# Altium project Discharge.PrjPcb
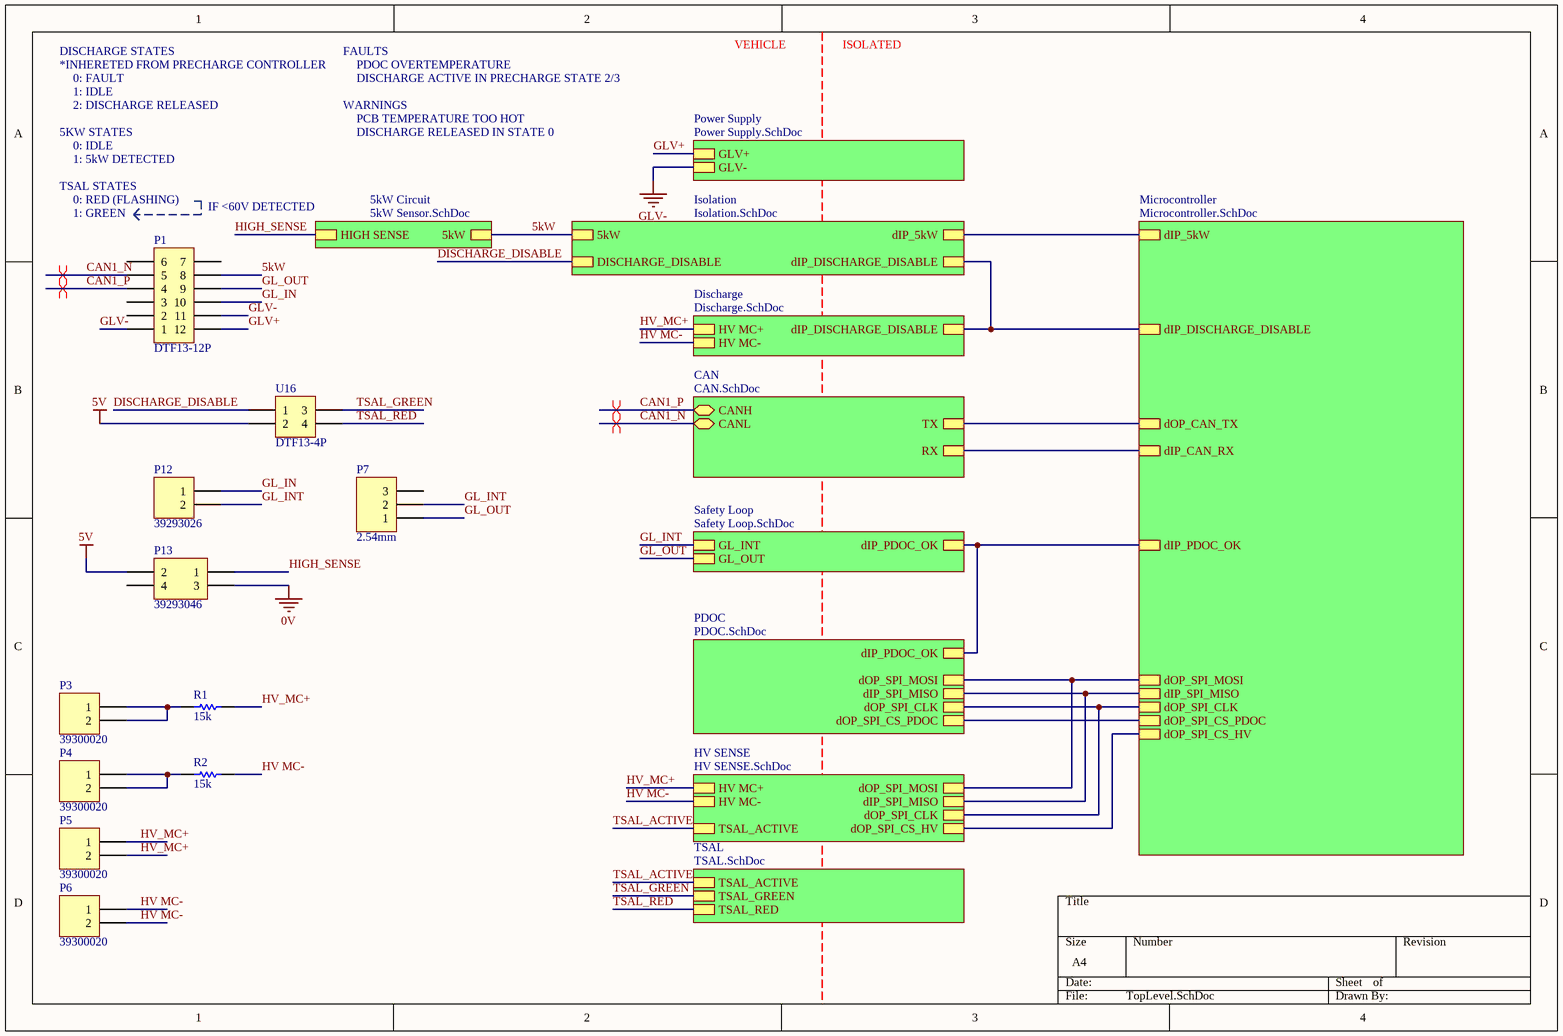
[diagram p0: TopLevel.SchDoc]
11 sheets, 172 parts. Net scope: hierarchical (ports join the sheet entries above them; power ports are global).
Board files: Discharge_B2.PcbDoc, Discharge_B3.PcbDoc, Discharge_B4.PcbDoc, Discharge_B5.PcbDoc
Sheets:
  TopLevel.SchDoc
    Power Supply = Power Supply.SchDoc
    Isolation = Isolation.SchDoc
    Safety Loop = Safety Loop.SchDoc
    Discharge = Discharge.SchDoc
    PDOC = PDOC.SchDoc
    HV SENSE = HV Sense.SchDoc
    Microcontroller = Microcontroller.SchDoc
    CAN = CAN.SchDoc
    5kW Circuit = 5kW Sensor.SchDoc
    TSAL = TSAL.SchDoc

## Sheet TopLevel.SchDoc
size A4; SheetNumber: 1; SheetTotal: 11

### Parts
P1  DTF13-12P  [DTF13-12P]
P3  39300020  [39300020]
P4  39300020  [39300020]
P5  39300020  [39300020]
P6  39300020  [39300020]
P7  2.54mm  [TH 2.54mm Header 1x3]
P12  39293026  [39293026]
P13  39293046  [39293046]
R1  15k  [TE_SMF7]
R2  15k  [TE_SMF7]
U16  DTF13-4P  [DTF13-4P]

### Sub-sheets
5kW Circuit = 5kW Sensor.SchDoc: 5kW, HIGH SENSE
CAN = CAN.SchDoc: CANH (bidir), CANL (bidir), TX, RX
Discharge = Discharge.SchDoc: dIP_DISCHARGE_DISABLE, HV MC+, HV MC-
HV SENSE = HV SENSE.SchDoc: HV MC+, HV MC-, dOP_SPI_MOSI, dIP_SPI_MISO, dOP_SPI_CLK, dOP_SPI_CS_HV, TSAL_ACTIVE
Isolation = Isolation.SchDoc: dIP_DISCHARGE_DISABLE, DISCHARGE_DISABLE, 5kW, dIP_5kW
Microcontroller = Microcontroller.SchDoc: dIP_PDOC_OK, dIP_DISCHARGE_DISABLE, dIP_5kW, dOP_CAN_TX, dIP_CAN_RX, dOP_SPI_MOSI, dIP_SPI_MISO, dOP_SPI_CLK, dOP_SPI_CS_PDOC, dOP_SPI_CS_HV
PDOC = PDOC.SchDoc: dIP_PDOC_OK, dOP_SPI_CLK, dOP_SPI_MOSI, dIP_SPI_MISO, dOP_SPI_CS_PDOC
Power Supply = Power Supply.SchDoc: GLV+, GLV-
Safety Loop = Safety Loop.SchDoc: GL_INT, GL_OUT, dIP_PDOC_OK
TSAL = TSAL.SchDoc: TSAL_GREEN, TSAL_RED, TSAL_ACTIVE

### Nets
0V: P13.3
5V: P13.2 U16.2
GLV-: P1.1 P1.11 ; sheet Power Supply/GLV-
HV MC-: P6.1 P6.2 R2.2 ; sheet Discharge/HV MC-, sheet HV SENSE/HV MC-
5kW: P1.8 ; sheet Isolation/5kW, sheet 5kW Circuit/5kW
CAN1_N: P1.5 ; sheet CAN/CANL
CAN1_P: P1.4 ; sheet CAN/CANH
DISCHARGE_DISABLE: U16.1 ; sheet Isolation/DISCHARGE_DISABLE
GL_IN: P1.10 P12.1
GL_INT: P7.2 P12.2 ; sheet Safety Loop/GL_INT
GL_OUT: P1.9 P7.1 ; sheet Safety Loop/GL_OUT
GLV+: P1.12 ; sheet Power Supply/GLV+
HIGH_SENSE: P13.1 ; sheet 5kW Circuit/HIGH SENSE
HV_MC+: P5.1 P5.2 R1.2 ; sheet Discharge/HV MC+, sheet HV SENSE/HV MC+  [project net HV MC +]
TSAL_ACTIVE: sheet HV SENSE/TSAL_ACTIVE, sheet TSAL/TSAL_ACTIVE
TSAL_GREEN: U16.3 ; sheet TSAL/TSAL_GREEN
TSAL_RED: U16.4 ; sheet TSAL/TSAL_RED
NetD17_K: sheet PDOC/dIP_SPI_MISO, sheet HV SENSE/dIP_SPI_MISO, sheet Microcontroller/dIP_SPI_MISO
NetP3_1: P3.1 P3.2 R1.1
NetP4_1: P4.1 P4.2 R2.1
NetR9_1: sheet Safety Loop/dIP_PDOC_OK, sheet PDOC/dIP_PDOC_OK, sheet Microcontroller/dIP_PDOC_OK
NetR11_1: sheet Isolation/dIP_DISCHARGE_DISABLE, sheet Discharge/dIP_DISCHARGE_DISABLE, sheet Microcontroller/dIP_DISCHARGE_DISABLE
NetR19_1: sheet Microcontroller/dOP_CAN_TX, sheet CAN/TX
NetR20_1: sheet Microcontroller/dIP_CAN_RX, sheet CAN/RX
NetR22_1: sheet HV SENSE/dOP_SPI_CS_HV, sheet Microcontroller/dOP_SPI_CS_HV
NetR23_1: sheet PDOC/dOP_SPI_CS_PDOC, sheet Microcontroller/dOP_SPI_CS_PDOC
NetU8_12: sheet PDOC/dOP_SPI_CLK, sheet HV SENSE/dOP_SPI_CLK, sheet Microcontroller/dOP_SPI_CLK
NetU8_14: sheet PDOC/dOP_SPI_MOSI, sheet HV SENSE/dOP_SPI_MOSI, sheet Microcontroller/dOP_SPI_MOSI
NetU8_15: sheet Isolation/dIP_5kW, sheet Microcontroller/dIP_5kW

Not connected (* = marked no-connect by the designer): P1 2 3 6 7; P7 3; P13 4

### Layout directives
differential pair: CAN1_N, CAN1_P

### Notes on the sheet
- DISCHARGE STATES
- *INHERETED FROM PRECHARGE CONTROLLER
- 0: FAULT
- 1: IDLE
- 2: DISCHARGE RELEASED
- FAULTS
- WARNINGS
- PDOC OVERTEMPERATURE
- DISCHARGE ACTIVE IN PRECHARGE STATE 2/3
- VEHICLE
- ISOLATED
- 5KW STATES
- 1: 5kW DETECTED
- 0: IDLE
- PCB TEMPERATURE TOO HOT
- DISCHARGE RELEASED IN STATE 0
- TSAL STATES
- 0: RED (FLASHING)
- (near P1) 1: GREEN
- (near P1) IF <60V DETECTED

### Library data of the parts
P1 = DTF13-12P: Positions: 12; Pitch: 4.45mm; Angle: 90; Flange: No; Contact: Copper Alloy; Part Number: DTF13-12P; Row Spacing: 4.45mm; Digikey Part Number: 1734-1861-ND; Digikey Link: https://www.digikey.com/products/en?keywords=dtf13-12pa
P3-P6 = 39300020: Pitch: 4.2mm; Row Spacing: 5.5mm; Angle: 90; Flange: No; Contact: Tin; Part Number: 39300020; Positions: 2; Digikey Part Number: WM21351-ND
P7 = TH 2.54mm Header 1x3: Positions: 3; Angle: 0; Flange: No; Contact: NA; Part Number: TH 2.54mm Header 1x3; Pitch: 2.54mm; Row Spacing: 2.54mm
P12 = 39293026: Pitch: 4.2mm; Row Spacing: 5.5mm; Angle: 0; Flange: No; Contact: Tin; Part Number: 39293026; Positions: 2; Digikey Part Number: WM3843-ND
P13 = 39293046: Pitch: 4.2mm; Row Spacing: 5.5mm; Angle: 0; Flange: No; Contact: Tin; Part Number: 39293046; Positions: 4; Digikey Part Number: WM3844-ND
R1 R2 = SMF715KJ: Manufacturer: TE; Tolerance: 0.05; Rated Power: 7W; Part Number: SMF715KJ; Value: 15k; Material: Metal Film
U16 = DTF13-4P: Positions: 4; Pitch: 9.12mm; Row Spacing: 4.45mm; Angle: 90; Flange: Yes; Contact: Copper Alloy; Part Number: DTF13-4P; Digikey Part Number: 1734-1646-ND; Digikey Link: https://www.digikey.com.au/products/en?keywords=dtf13-4p

## Sheet Power Supply.SchDoc
size A4; SheetNumber: 3; SheetTotal: 11
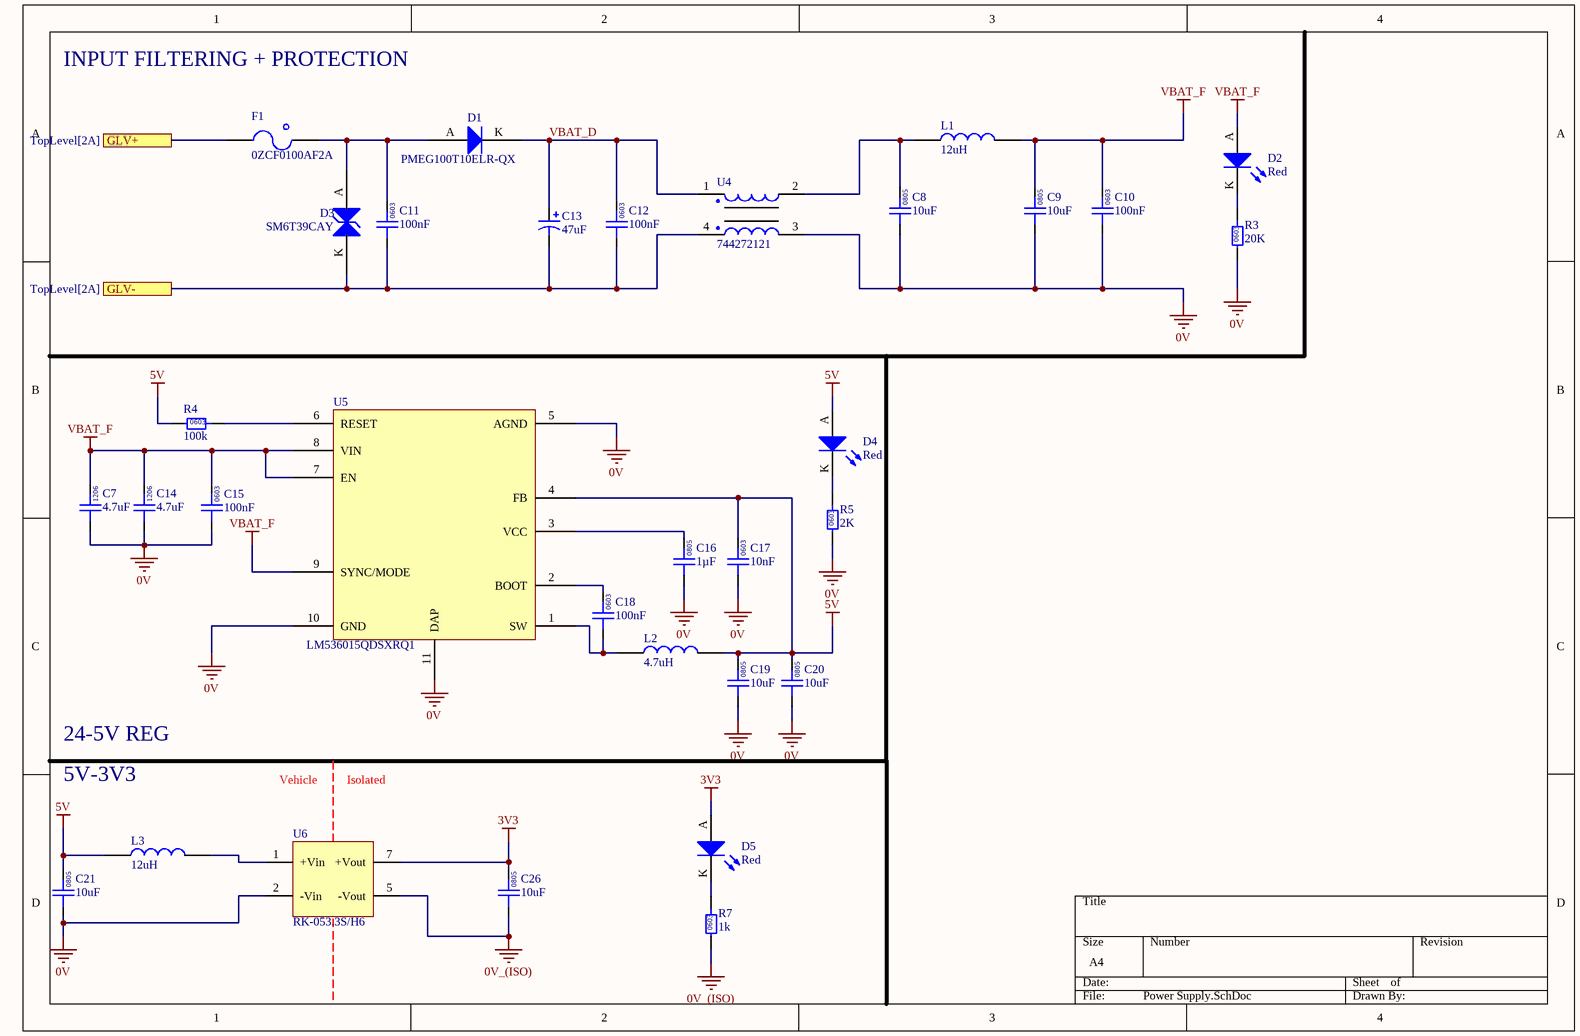
[diagram p1: Power Supply.SchDoc]

### Parts
C7  4.7uF  [1206 CAP]
C8  10uF  [0805]
C9  10uF  [0805]
C10  100nF  [0603]
C11  100nF  [0603]
C12  100nF  [0603]
C13  47uF  [CHEMI-CON ELCO]
C14  4.7uF  [1206 CAP]
C15  100nF  [0603]
C16  1µF  [0805]
C17  10nF  [0603]
C18  100nF  [0603]
C19  10uF  [0805]
C20  10uF  [0805]
C21  10uF  [0805]
C26  10uF  [0805]
D1  PMEG100T10ELR-QX  [SODFL350X110-2N]
D2  Red  [0805 LED]
D3  SM6T39CAY  [SM6T39CAY-Footprint-1]
D4  Red  [0805 LED]
D5  Red  [0805 LED]
F1  0ZCF0100AF2A  [2920]
L1  12uH  [1812]
L2  4.7uH  [SRN3015TA-4R7M]
L3  12uH  [1812]
R3  20K  [0603]
R4  100k  [0603]
R5  2K  [0603]
R7  1k  [0603]
U4  744272121  [Wurth 4-PC Pad]
U5  LM536015QDSXRQ1  [TI_10_WSON]
U6  RK-053.3S/H6  [RK-053.3S/H6]

### Ports
GLV+ (see TopLevel[2A]), GLV- (see TopLevel[2A])

### Nets
0V: C7.1 C8.1 C9.1 C10.1 C14.1 C15.1 C16.1 C17.1 C19.1 C20.1 C21.1 R3.1 R5.1 U4.3 U5.5(AGND) U5.10(GND) U5.11(DAP) U6.2(-Vin)
0V_(ISO): C26.1 R7.1 U6.5(-Vout)
3V3: C26.2 D5.A U6.7(+Vout)
5V: C17.2 C19.2 C20.2 C21.2 D4.A L2.1 L3.2 R4.1 U5.4(FB)
GLV-: C11.1 C12.1 C13.1 D3.K U4.4 ; port GLV-
VBAT_F: C7.2 C9.2 C10.2 C14.2 C15.2 D2.A L1.1 U5.7(EN) U5.8(VIN) U5.9(SYNC/MODE)
GLV+: F1.1 ; port GLV+
VBAT_D: C12.2 C13.2 D1.K U4.1
NetC8_2: C8.2 L1.2 U4.2
NetC11_2: C11.2 D1.A D3.A F1.2
NetC16_2: C16.2 U5.3(VCC)
NetC18_1: C18.1 L2.2 U5.1(SW)
NetC18_2: C18.2 U5.2(BOOT)
NetD2_K: D2.K R3.2
NetD4_K: D4.K R5.2
NetD5_K: D5.K R7.2
NetL3_1: L3.1 U6.1(+Vin)
NetR4_2: R4.2 U5.6(RESET)

### Notes on the sheet
- INPUT FILTERING + PROTECTION
- 5V-3V3
- 24-5V REG
- Vehicle
- Isolated
- (in symbol GCM21BR71H105KA03L) 0805
- (in symbol GCM188L81H103KA03D) 0603
- (in symbol GCM188L81H104KA57D) 0603
- (in symbol GRM21BR6YA106KE43L) 0805
- (in symbol GRM31CR71H475KA12K) 1206
- (in symbol RC0603FR-071KL) 0603
- (in symbol RC0603FR-072KL) 0603
- (in symbol RC0603FR-0710KL) 0603
- (in symbol RC0603FR-0720KL) 0603

### Library data of the parts
C7 C14 = GRM31CR71H475KA12K: Manufacturer: Murata Electronics; Rated Voltage: 50V; Tolerance: ±10%; Material: MLCC; Temperature Rating: X7R; Part Number: GRM31CR71H475KA12K; Value: 4.7uF; Digikey Part Number: 490-GRM31CR71H475KA12KTR-ND
C8 C9 C19-C21 C26 = GRM21BR6YA106KE43L: Manufacturer: muRata; Rated Voltage: 50V; Tolerance: 10%; Material: MLCC; Temperature Rating: X5R; Part Number: GRM21BR6YA106KE43L; Value: 10uF; Digikey Part Number: 490-10514-6-ND
C10-C12 C15 C18 = GCM188L81H104KA57D: Manufacturer: muRata; Rated Voltage: 50V; Tolerance: ±10%; Material: MLCC; Temperature Rating: X8L; Part Number: GCM188L81H104KA57D; Value: 100nF; Digikey Part Number: 490-6049-1-ND
C13 = HHXA350ARA470MF61G: Part Number: HHXA350ARA470MF61G
C16 = GCM21BR71H105KA03L: Manufacturer: muRata; Rated Voltage: 50V; Tolerance: ±10%; Material: MLCC; Temperature Rating: X7R; Part Number: GCM21BR71H105KA03L; Value: 1µF; Digikey Part Number: 490-10675-1-ND
C17 = GCM188L81H103KA03D: Manufacturer: muRata; Rated Voltage: 50V; Tolerance: ±10%; Material: MLCC; Temperature Rating: X8L; Part Number: GCM188L81H103KA03D; Value: 10nF; Digikey Part Number: 490-GCM188L81H103KA03DCT-ND
D1 = CMP-004-00005-4: Diode 100 V 1A Surface Mount SOD-123W
D2 D4 D5 = SML-210LTT86: Red LED Indication - Discrete 1.75V 0805 (2012 Metric); Manufacturer: ROHM Semiconductor; Part Number: SML-210LTT86; Colour: Red; Digikey Part Number: 511-1286-1-ND
D3 = CMP-004-00003-4: TVS Diode Single Bi-Dir 33.3V 600W Automotive 2-Pin SMB T/R / TVS DIODE 33.3VWM 69.7VC SMB; Peak Pulse Current: 57A; Polarity: Bidirectional; Min Breakdown Voltage: 37.1V; Test Current: 1mA; Number of Elements: 1; Operating Supply Voltage: 30V; Diode Type: ZENER; Clamping Voltage: 53.9V; Leakage Current: 200nA; Power Line Protection: No; Max Surge Current: 11.1A; Max Breakdown Voltage: 41V; Breakdown Voltage: 39V; Max Power Dissipation: 600W; Radiation Hardening: No; Resistor Type: Zener; Termination: SMD/SMT; REACH SVHC: No SVHC; Reverse Breakdown Voltage: 37.1V; Max Operating Temperature: 150°C; Min Operating Temperature: -55°C; Element Configuration: Single; Length: 4.6mm; Case/Package: DO-214AA; Reverse Standoff Voltage: 33.3V; Number of Bidirectional Channels: 1; Number of Pins: 2; Direction: Bidirectional; Mount: Surface Mount; Package Quantity: 1; Width: 3.95mm; RoHS Compliant: Yes; Number of Channels: 1; Packaging: Tape and Reel; Max Reverse Leakage Current: 200nA; Peak Pulse Power: 600W; Height: 2.45mm; Series: Automotive, AEC-Q101, SM6TY, TRANSIL™
F1 = 0ZCF0100AF2A: PTC RESET FUSE 60V 1A 292; Manufacturer: Littelfuse Inc.; Part Number: 0ZCF0100AF2A; Digikey Part Number: 507-2070-1-ND; Digikey Link: https://www.digikey.com/product-detail/en/bel-fuse-inc/0ZCF0100AF2A/507-2070-1-ND/6210547
L1 L3 = RLS-126: Manufacturer: Recom; Tolerance: 0.2; Impedance: 230mOhm; Rated Current: 0.8 A; Material: Wirewound; Part Number: RLS-126; Value: 12uH; Digikey Part Number: 945-3429-ND
L2 = SRN4018-4R7M: Manufacturer: Bourns; Tolerance: 0.2; Impedance: 84mOhms; Rated Current: 1.9A; Material: Wirewound; Part Number: SRN4018-4R7M; Value: 4.7uH; Digikey Part Number: SRN3015TA-4R7MCT-ND
R3 = RC0603FR-0720KL: Manufacturer: YAGEO; Tolerance: 0.01; Rated Power: 0.1W; Part Number: RC0603FR-0720KL; Value: 20K; Digikey Part Number: 311-20.0KHRCT-ND; Material: FR-07
R4 = RC0603FR-0710KL: Manufacturer: YAGEO; Value: 10k; Tolerance: 0.01; Rated Power: 0.1W; Part Number: RC0603FR-0710KL; Material: FR-07; Digikey Part Number: 311-10.0KHRCT-ND
R5 = RC0603FR-072KL: Manufacturer: YAGEO; Tolerance: 0.01; Rated Power: 0.1W; Part Number: RC0603FR-072KL; Value: 2K; Digikey Part Number: 311-2.00KHRCT-ND; Material: FR-07
R7 = RC0603FR-071KL: Manufacturer: YAGEO; Tolerance: 0.01; Rated Power: 0.1W; Part Number: RC0603FR-071KL; Value: 1k; Digikey Part Number: 311-1.00KHRCT-ND; Material: FR-07
U4 = 744272121: Manufacturer: Wurth Electronics Inc; Value: 120uH @ 100kHz; Impedance: 460 Ohms @ 30MHz; Rated Current: 2.5 A; Part Number: 744272121; Material: Wirewound; Digikey Part Number: 732-1489-1-ND
U5 = LM536015QDSXRQ1: DC DC CONVERTER 5V; Manufacturer: Texas Instruments; Input Voltage: 4.5 to 36 V; Output Current: 1.0 A; Part Number: LM536015QDSXRQ1; Output Voltage: 5V; Digikey Part Number: 296-50359-1-ND
U6 = RK-053.3S/H6: DC DC CONVERTER 3.3V 1W; Manufacturer: Recom; Input Voltage: 5V; Output Current: 303mA; Part Number: RK-053.3S/H6; Output Voltage: 3.3V

## Sheet Isolation.SchDoc
size A4; SheetNumber: 10; SheetTotal: 11
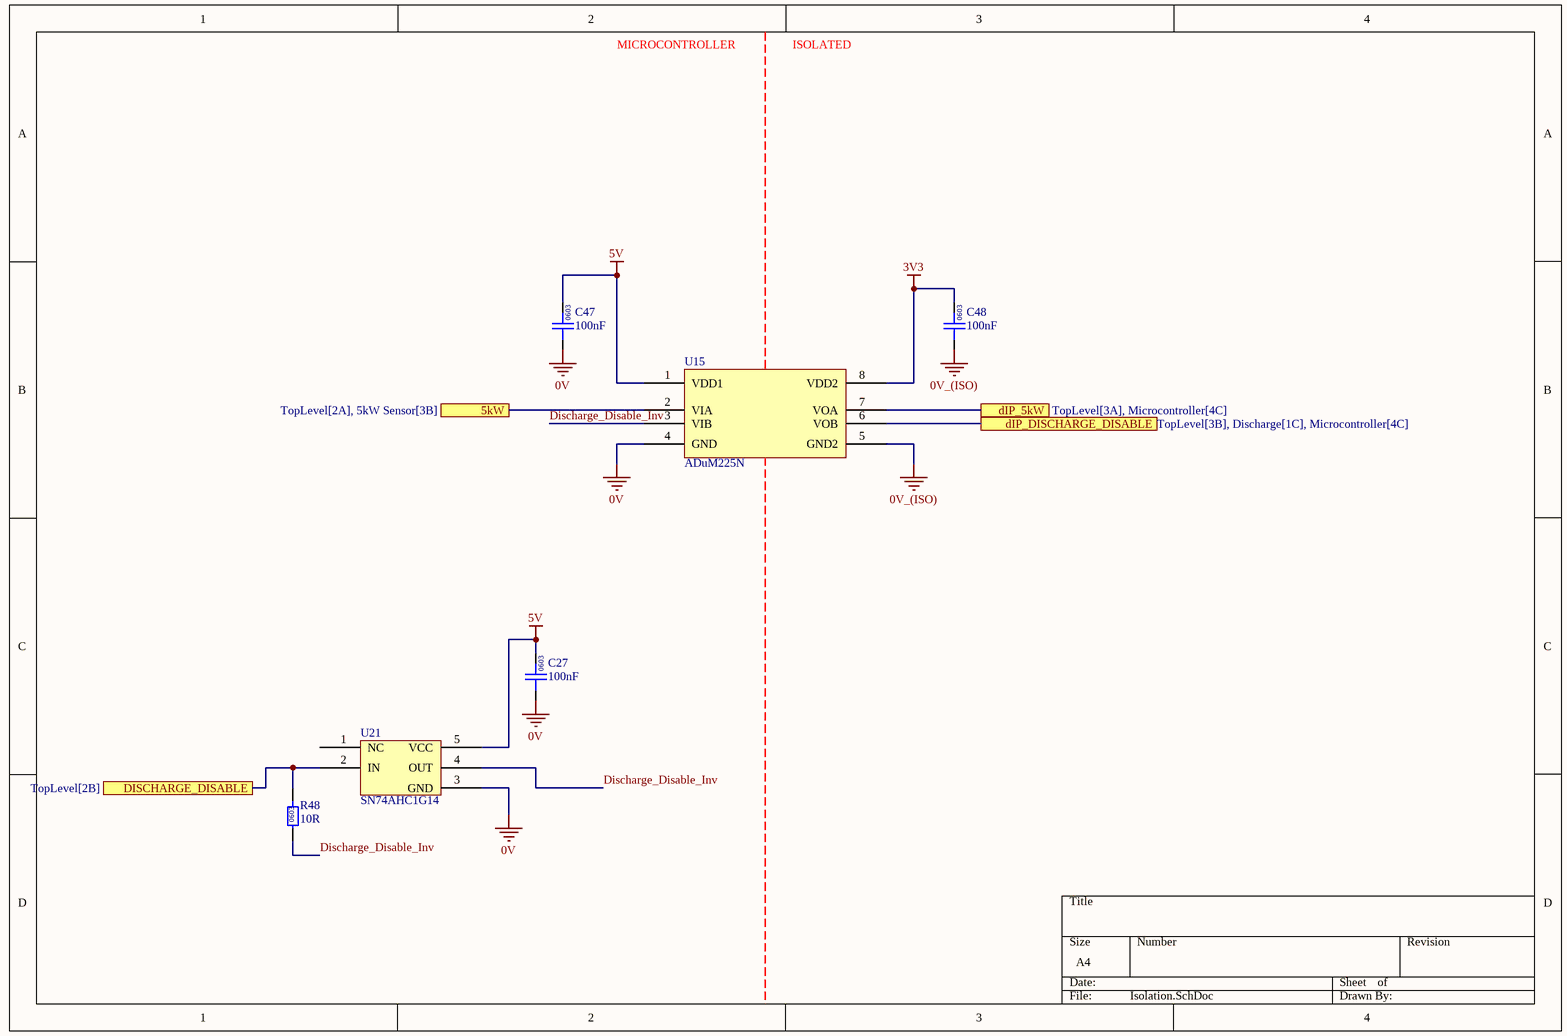
[diagram p2: Isolation.SchDoc]

### Parts
C27  100nF  [0603]
C47  100nF  [0603]
C48  100nF  [0603]
R48  10R  [0603]
U15  ADuM225N  [AD-SOIC-8W]
U21  SN74AHC1G14  [SOT23-5_TI]

### Ports
5kW (see TopLevel[2A], 5kW Sensor[3B]), dIP_5kW (see TopLevel[3A], Microcontroller[4C]), dIP_DISCHARGE_DISABLE (see TopLevel[3B], Discharge[1C], Microcontroller[4C]), DISCHARGE_DISABLE (see TopLevel[2B])

### Nets
0V: C27.1 C47.1 U15.4(GND) U21.3(GND)
0V_(ISO): C48.1 U15.5(GND2)
3V3: C48.2 U15.8(VDD2)
5V: C27.2 C47.2 U15.1(VDD1) U21.5(VCC)
5kW: U15.2(VIA) ; port 5kW
DISCHARGE_DISABLE: R48.2 U21.2(IN) ; port DISCHARGE_DISABLE
Discharge_Disable_Inv: R48.1 U15.3(VIB) U21.4(OUT)
NetR11_1: U15.6(VOB) ; port dIP_DISCHARGE_DISABLE
NetU8_15: U15.7(VOA) ; port dIP_5kW

Not connected (* = marked no-connect by the designer): U21 1(NC)

### Notes on the sheet
- MICROCONTROLLER
- ISOLATED
- (in symbol GCM188L81H104KA57D) 0603
- (in symbol RC0603FR-0710RL) 0603

### Library data of the parts
C27 C47 C48 = GCM188L81H104KA57D: as C10 on sheet Power Supply; Part Number: GCM188L81H104KA57D; Value: 100nF; Digikey Part Number: 490-6049-1-ND
R48 = RC0603FR-0710RL: Manufacturer: YAGEO; Tolerance: 0.01; Rated Power: 0.1W; Part Number: RC0603FR-0710RL; Value: 10R; Material: FR-07; Digikey Part Number: 311-10.0HRCT-ND
U15 = ADuM225N: DIGITAL ISOLATOR, DUAL CHANNEL; Manufacturer: Analogue Devices; Part Number: ADuM225N
U21 = SN74AHC1G14: IC INVERTER 1CH 1-INP SOT23-5; Manufacturer: Texas Instruments; Complex IC: 1; Part Number: SN74AHC1G14

## Sheet Safety Loop.SchDoc
size A4; SheetNumber: 4; SheetTotal: 11
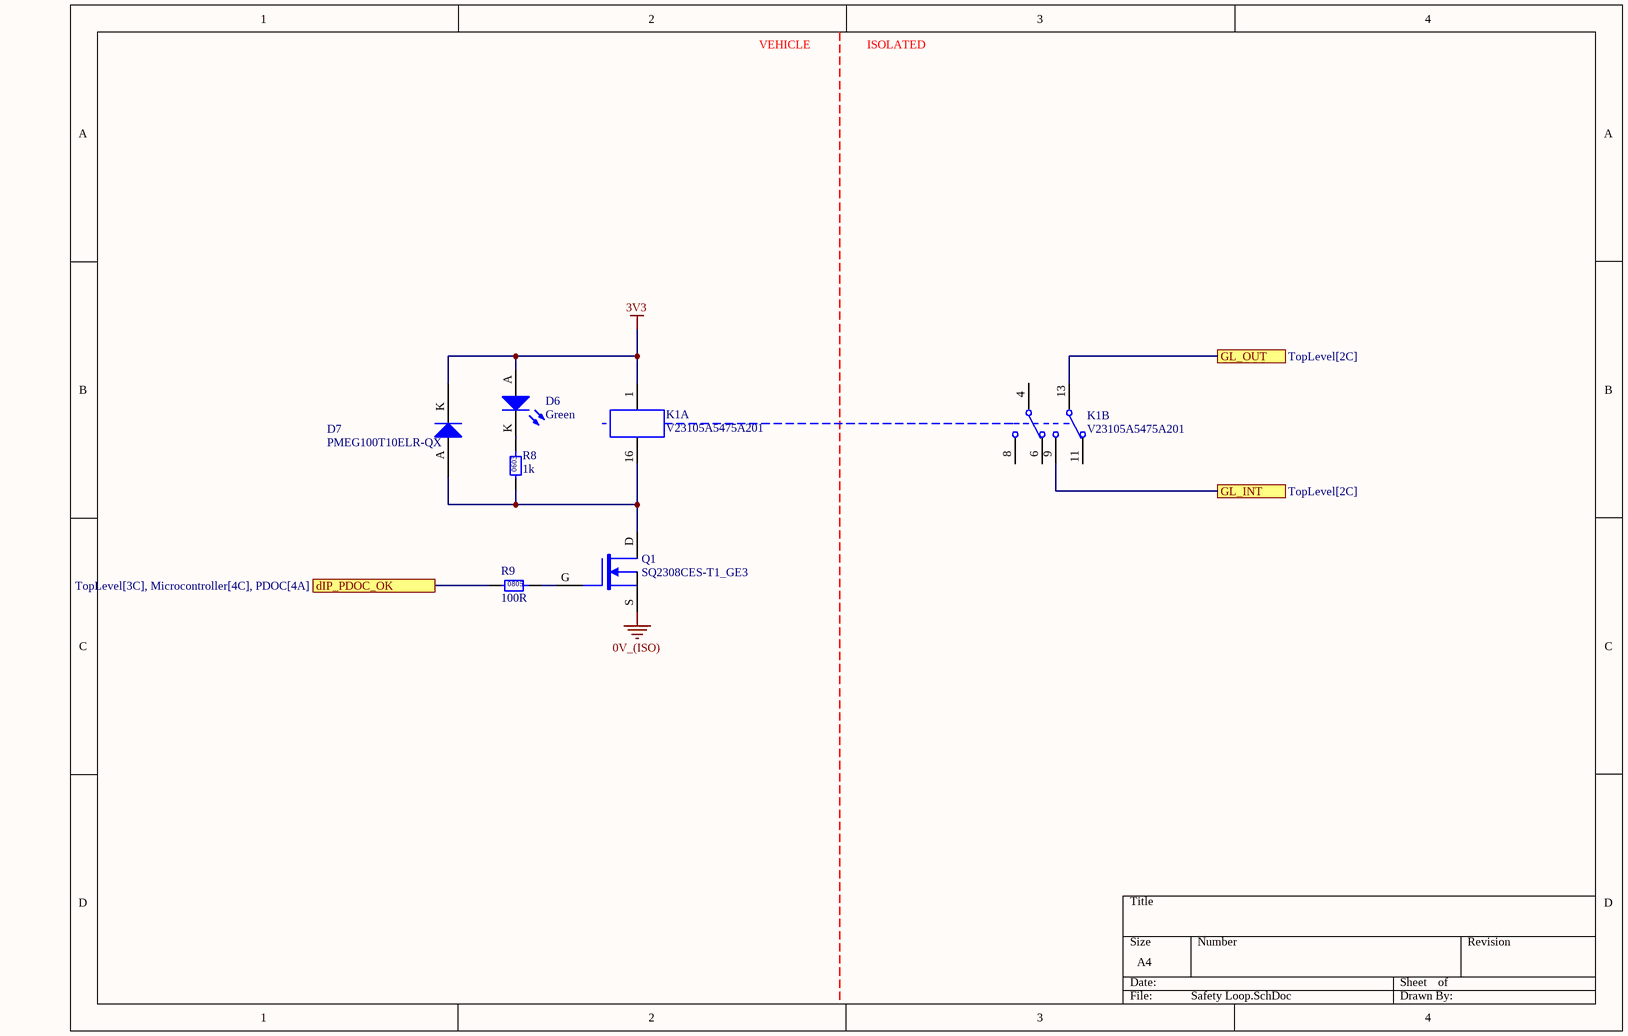
[diagram p3: Safety Loop.SchDoc]

### Parts
D6  Green  [0805 LED]
D7  PMEG100T10ELR-QX  [SODFL350X110-2N]
K1  V23105A5475A201  [TI 2-DIL]  (parts A,B of 2)
Q1  SQ2308CES-T1_GE3  [VSHY SOT-23-3]
R8  1k  [0603]
R9  100R  [0805]

### Ports
dIP_PDOC_OK (see TopLevel[3C], Microcontroller[4C], PDOC[4A]), GL_INT (see TopLevel[2C]), GL_OUT (see TopLevel[2C])

### Nets
0V_(ISO): Q1.S
3V3: D6.A D7.K K1.1
GL_INT: K1.9 ; port GL_INT
GL_OUT: K1.13 ; port GL_OUT
NetD6_K: D6.K R8.2
NetD7_A: D7.A K1.16 Q1.D R8.1
NetQ1_G: Q1.G R9.2
NetR9_1: R9.1 ; port dIP_PDOC_OK

Not connected (* = marked no-connect by the designer): K1 4 6 8 11

### Notes on the sheet
- VEHICLE
- ISOLATED
- (in symbol RC0603FR-071KL) 0603
- (in symbol RC0805FR07100RL) 0805

### Library data of the parts
D6 = SML-210FTT86: Green LED Indication - Discrete 1.75V 0805 (2012 Metric); Manufacturer: ROHM Semiconductor; Part Number: SML-210FTT86; Colour: Green; Digikey Part Number: 511-1285-1-ND
D7 = CMP-004-00005-4: Diode 100 V 1A Surface Mount SOD-123W
K1 = CMP-036-000001-1: 5V DPDT Relay 3A 220VDC; Part Number: V23105A5475A201
Q1 = SQ2308CES-T1_GE3: MOSFET N-CH 60V 2.3A SOT23; Manufacturer: Vishay Siliconix; Type: N-channel; Rated Power: 2W; Published: 24-Mar-1999; LatestRevisionDate: 29-May-2009; LatestRevisionNote: IPC-7351 Footprint Added.; PackageVersion: Sep-2000; PackageReference: SOT-343; Publisher: Altium Limited; PackageDescription: 4-Pin SOT-343 Package 1.3 mm Pitch, 2.1 mm Lead Span; Part Number: SQ2308CES-T1_GE3; Digikey Part Number: SQ2308CES-T1_GE3CT-ND
R8 = RC0603FR-071KL: as R7 on sheet Power Supply; Part Number: RC0603FR-071KL; Value: 1k; Digikey Part Number: 311-1.00KHRCT-ND; Material: FR-07
R9 = RC0805FR07100RL: Manufacturer: YAGEO; Tolerance: 0.01; Rated Power: 0.125W; Part Number: RC0805FR07100RL; Value: 100R; Material: FR-07; Digikey Part Number: 311-100CRCT-ND

## Sheet Discharge.SchDoc
size A4; SheetNumber: 5; SheetTotal: 11
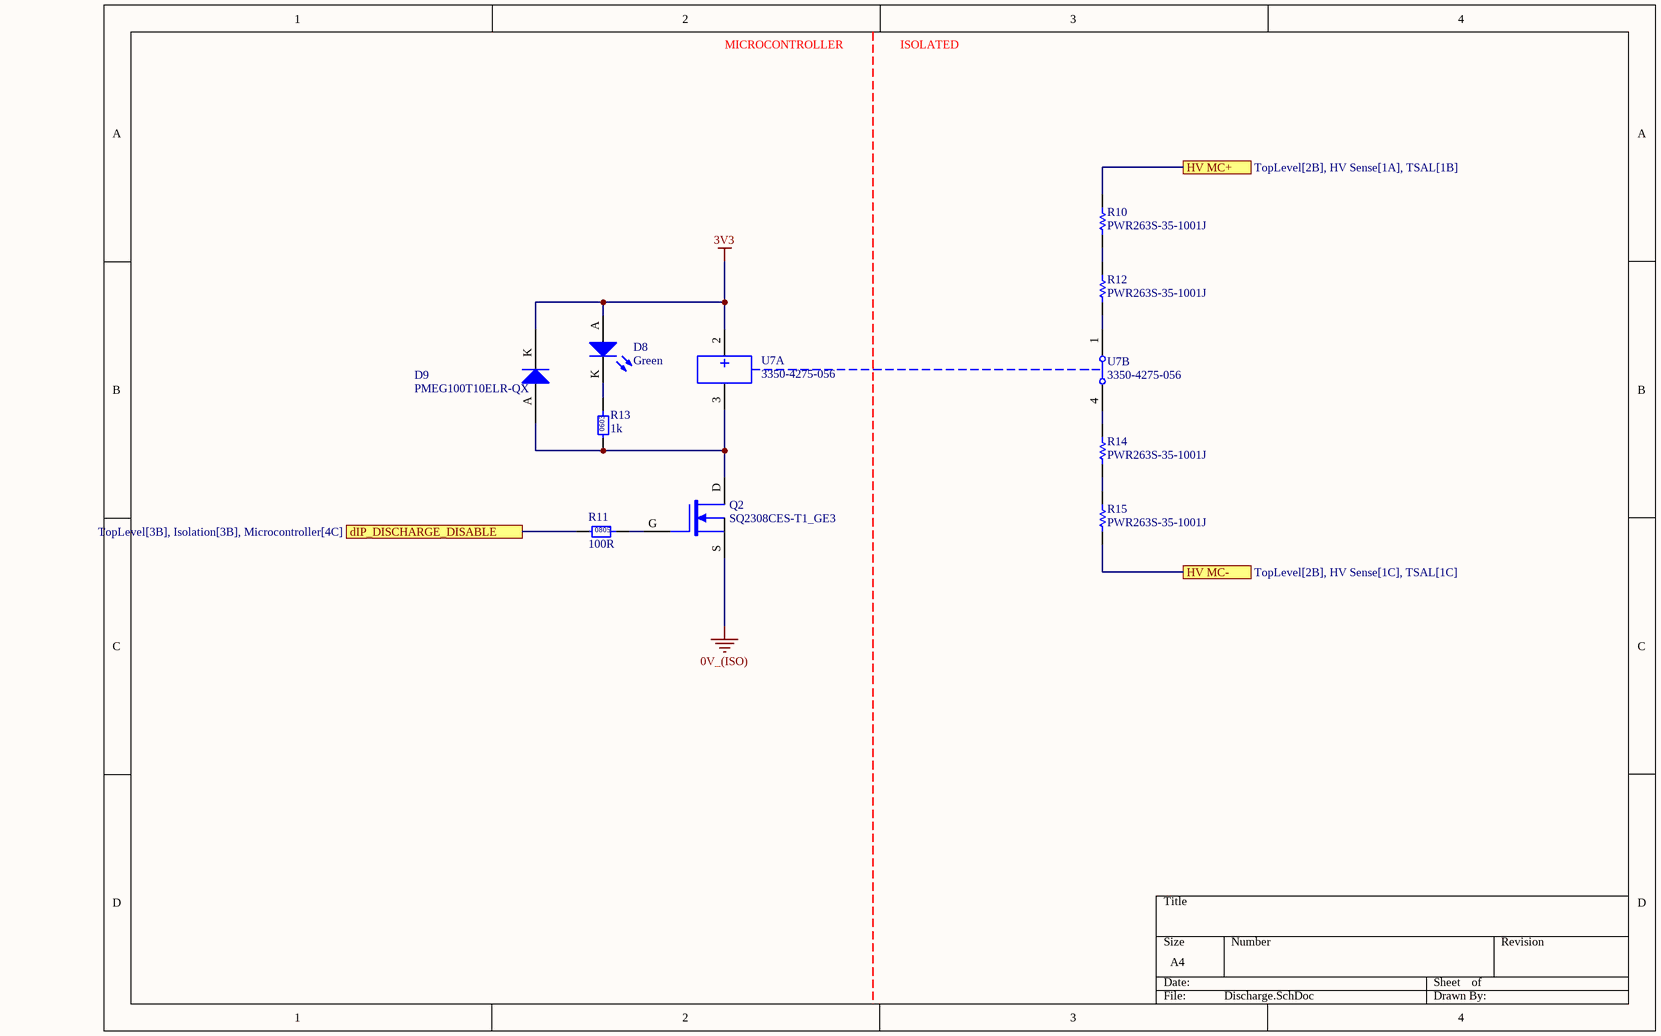
[diagram p4: Discharge.SchDoc]

### Parts
D8  Green  [0805 LED]
D9  PMEG100T10ELR-QX  [SODFL350X110-2N]
Q2  SQ2308CES-T1_GE3  [VSHY SOT-23-3]
R10  PWR263S-35-1001J  [B TO-263]
R11  100R  [0805]
R12  PWR263S-35-1001J  [B TO-263]
R13  1k  [0603]
R14  PWR263S-35-1001J  [B TO-263]
R15  PWR263S-35-1001J  [B TO-263]
U7  3350-4275-056  [CI SPST]  (parts A,B of 2)

### Ports
dIP_DISCHARGE_DISABLE (see TopLevel[3B], Isolation[3B], Microcontroller[4C]), HV MC+ (see TopLevel[2B], HV Sense[1A], TSAL[1B]), HV MC- (see TopLevel[2B], HV Sense[1C], TSAL[1C])

### Nets
0V_(ISO): Q2.S
3V3: D8.A D9.K U7.2
HV MC-: R15.2 ; port HV MC-
HV MC +: R10.1 ; port HV MC+
NetD8_K: D8.K R13.2
NetD9_A: D9.A Q2.D R13.1 U7.3
NetQ2_G: Q2.G R11.2
NetR10_2: R10.2 R12.1
NetR11_1: R11.1 ; port dIP_DISCHARGE_DISABLE
NetR12_2: R12.2 U7.1
NetR14_1: R14.1 U7.4
NetR14_2: R14.2 R15.1

### Notes on the sheet
- MICROCONTROLLER
- ISOLATED
- (in symbol RC0603FR-071KL) 0603
- (in symbol RC0805FR07100RL) 0805

### Library data of the parts
D8 = SML-210FTT86: as D6 on sheet Safety Loop; Part Number: SML-210FTT86; Colour: Green; Digikey Part Number: 511-1285-1-ND
D9 = CMP-004-00005-4: Diode 100 V 1A Surface Mount SOD-123W
Q2 = SQ2308CES-T1_GE3: as Q1 on sheet Safety Loop; Published: 24-Mar-1999; LatestRevisionDate: 29-May-2009; LatestRevisionNote: IPC-7351 Footprint Added.; PackageVersion: Sep-2000; PackageReference: SOT-343; Publisher: Altium Limited; PackageDescription: 4-Pin SOT-343 Package 1.3 mm Pitch, 2.1 mm Lead Span; Part Number: SQ2308CES-T1_GE3; Digikey Part Number: SQ2308CES-T1_GE3CT-ND
R10 R12 R14 R15 = CMP-037-000402-1: Manufacturer: Bournes Inc; Value: 1k; Rated Voltage: 35W; Tolerance: 0.05; Part Number: PWR263S-35-1001J; Digikey Part Number: PWR263S-35-1001J-ND
R11 = RC0805FR07100RL: as R9 on sheet Safety Loop; Part Number: RC0805FR07100RL; Value: 100R; Material: FR-07; Digikey Part Number: 311-100CRCT-ND
R13 = RC0603FR-071KL: as R7 on sheet Power Supply; Part Number: RC0603FR-071KL; Value: 1k; Digikey Part Number: 311-1.00KHRCT-ND; Material: FR-07
U7 = CMP-035-000005-1: RELAY REED HV SPST 200W 3A 5V (NC); Part Number: 3350-4275-056

## Sheet PDOC.SchDoc
size A4; SheetNumber: 8; SheetTotal: 10
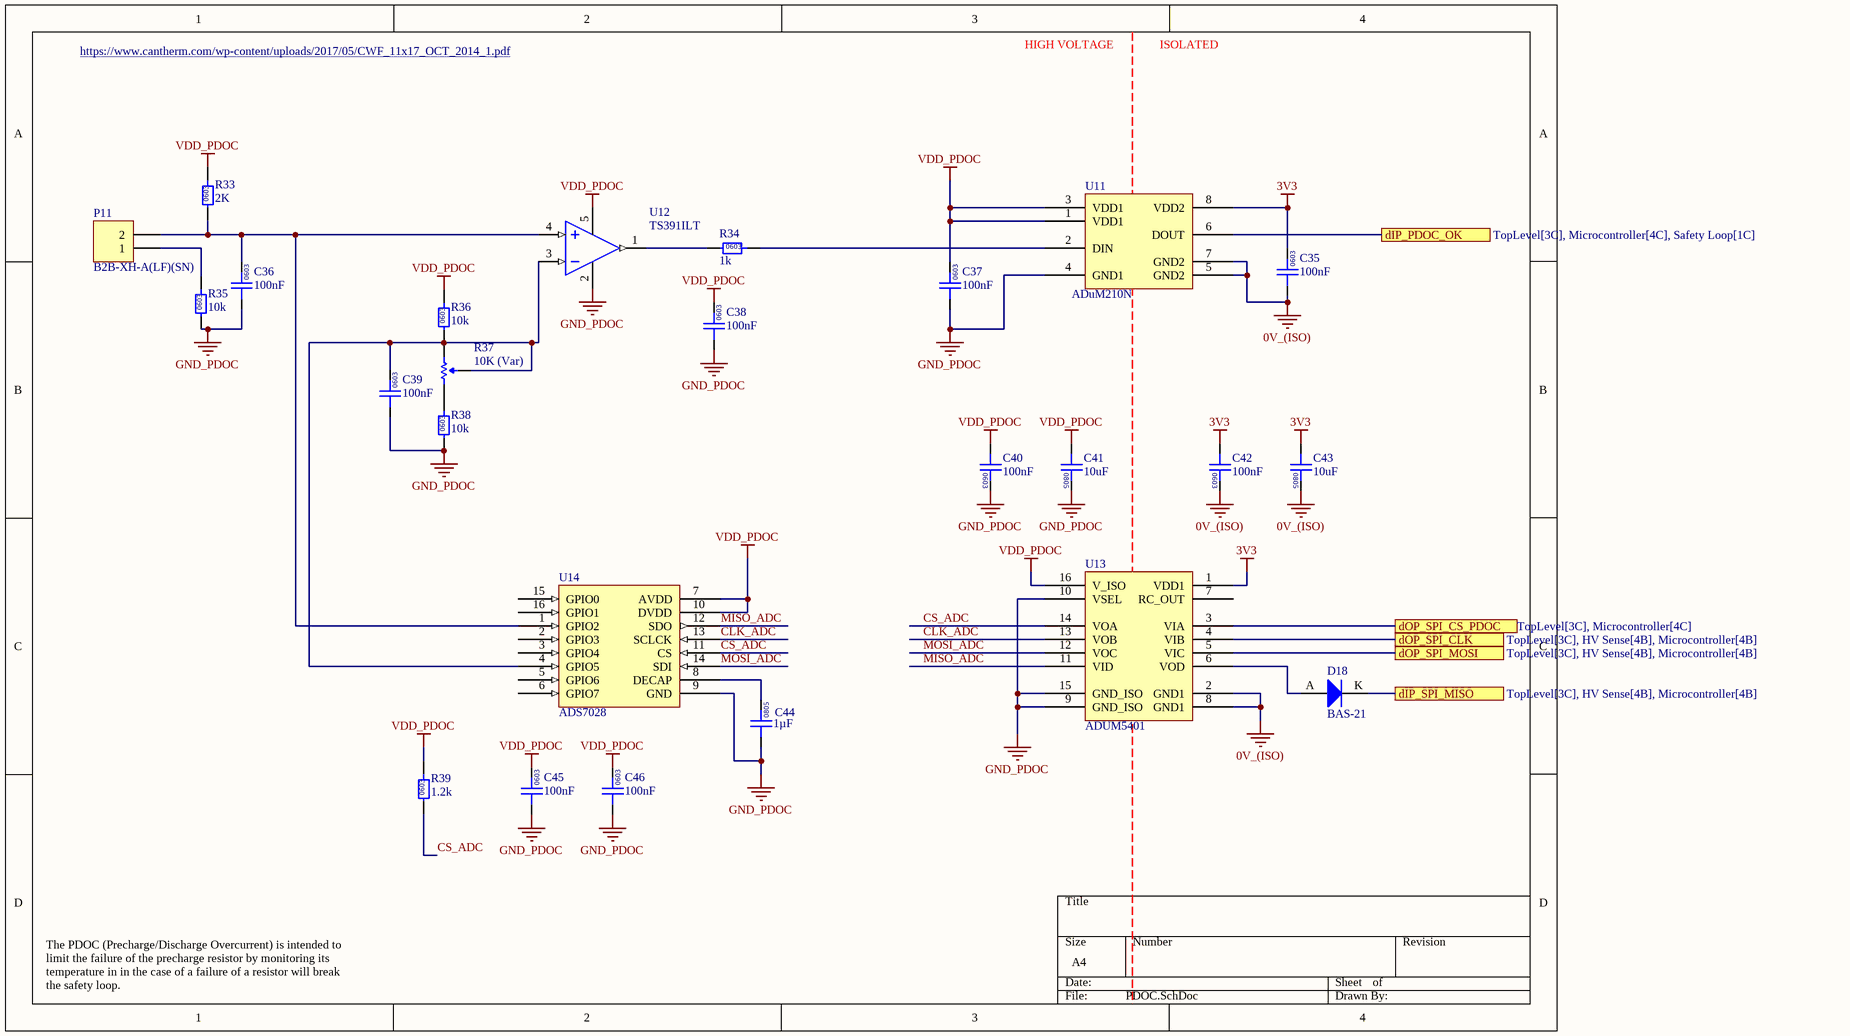
[diagram p5: PDOC.SchDoc]

### Parts
C35  100nF  [0603]
C36  100nF  [0603]
C37  100nF  [0603]
C38  100nF  [0603]
C39  100nF  [0603]
C40  100nF  [0603]
C41  10uF  [0805]
C42  100nF  [0603]
C43  10uF  [0805]
C44  1µF  [0805]
C45  100nF  [0603]
C46  100nF  [0603]
D18  BAS-21  [NEXPERIA_SOT23]
P11  B2B-XH-A(LF)(SN)  [XH 2 PIN VERT]
R33  2K  [0603]
R34  1k  [0603]
R35  10k  [0603]
R36  10k  [0603]
R37  10K (Var)  [B 3296]
R38  10k  [0603]
R39  1.2k  [0603]
U11  ADuM210N  [SOIC-8W]
U12  TS391ILT  [ON SOT-23-5]
U13  ADUM5401  [AD 16-SOIC]
U14  ADS7028  [WFQN-16]

### Ports
dIP_PDOC_OK (see TopLevel[3C], Microcontroller[4C], Safety Loop[1C]), dIP_SPI_MISO (see TopLevel[3C], HV Sense[4B], Microcontroller[4B]), dOP_SPI_CLK (see TopLevel[3C], HV Sense[4B], Microcontroller[4B]), dOP_SPI_CS_PDOC (see TopLevel[3C], Microcontroller[4C]), dOP_SPI_MOSI (see TopLevel[3C], HV Sense[4B], Microcontroller[4B])

### Nets
0V_(ISO): C35.1 C42.2 C43.2 U11.5(GND2) U11.7(GND2) U13.2(GND1) U13.8(GND1)
3V3: C35.2 C42.1 C43.1 U11.8(VDD2) U13.1(VDD1)
GND_PDOC: C36.1 C37.1 C38.1 C39.1 C40.2 C41.2 C44.1 C45.1 C46.1 R35.1 R38.1 U11.4(GND1) U12.2(VCC-) U13.9(GND_ISO) U13.10(VSEL) U13.15(GND_ISO) U14.9(GND)
VDD_PDOC: C37.2 C38.2 C40.1 C41.1 C45.2 C46.2 R33.2 R36.2 R39.2 U11.1(VDD1) U11.3(VDD1) U12.5(VCC+) U13.16(V_ISO) U14.7(AVDD) U14.10(DVDD)
CLK_ADC: U13.13(VOB) U14.13(SCLCK)
CS_ADC: R39.1 U13.14(VOA) U14.11(CS)
MISO_ADC: U13.11(VID) U14.12(SDO)
MOSI_ADC: U13.12(VOC) U14.14(SDI)
NetC36_2: C36.2 P11.2 R33.1 U12.4(IIN+) U14.1(GPIO2)
NetC39_2: C39.2 R36.1 R37.1(CCW) R37.2(Wiper) U12.3(IN-) U14.4(GPIO5)
NetC44_2: C44.2 U14.8(DECAP)
NetD17_K: D18.K ; port dIP_SPI_MISO
NetD18_A: D18.A U13.6(VOD)
NetP11_1: P11.1 R35.2
NetR9_1: U11.6(DOUT) ; port dIP_PDOC_OK
NetR23_1: U13.3(VIA) ; port dOP_SPI_CS_PDOC
NetR34_1: R34.1 U12.1(OUT)
NetR34_2: R34.2 U11.2(DIN)
NetR37_3: R37.3(CW) R38.2
NetU8_12: U13.4(VIB) ; port dOP_SPI_CLK
NetU8_14: U13.5(VIC) ; port dOP_SPI_MOSI

Not connected (* = marked no-connect by the designer): U13 7(RC_OUT); U14 2(GPIO3) 3(GPIO4) 5(GPIO6) 6(GPIO7) 15(GPIO0) 16(GPIO1)

### Notes on the sheet
- https://www.cantherm.com/wp-content/uploads/2017/05/CWF_11x17_OCT_2014_1.pdf
- HIGH VOLTAGE
- ISOLATED
- The PDOC (Precharge/Discharge Overcurrent) is intended to limit the failure of the precharge resistor by monitoring its temperature in in the case of a failure of a resistor will break the safety loop.
- (in symbol GCM21BR71H105KA03L) 0805
- (in symbol GCM188L81H104KA57D) 0603
- (in symbol GRM21BR6YA106KE43L) 0805
- (in symbol RC0603FR-071KL) 0603
- (in symbol RC0603FR-072KL) 0603
- (in symbol RC0603FR-0710KL) 0603
- (in symbol RC0603JR-071K2L) 0603

### Library data of the parts
C35-C40 C42 C45 C46 = GCM188L81H104KA57D: as C10 on sheet Power Supply; Part Number: GCM188L81H104KA57D; Value: 100nF; Digikey Part Number: 490-6049-1-ND
C41 C43 = GRM21BR6YA106KE43L: as C8 on sheet Power Supply; Part Number: GRM21BR6YA106KE43L; Value: 10uF; Digikey Part Number: 490-10514-6-ND
C44 = GCM21BR71H105KA03L: as C16 on sheet Power Supply; Part Number: GCM21BR71H105KA03L; Value: 1µF; Digikey Part Number: 490-10675-1-ND
D18 = BAS-21: Manufacturer: Nexperia USA Inc.; Forward Voltage: 1.0V; Breakdown Voltage: 250V; Rated Power: 250mW; Part Number: BAS-21
P11 = B2B-XH-A(LF)(SN): Positions: 2; Pitch: 2.54mm; Angle: 0; Flange: No; Contact: Tin; Part Number: B2B-XH-A(LF)(SN); Row Spacing: 2.54mm; Digikey Part Number: 455-2247-ND; Digikey Link: https://www.digikey.com.au/en/products/detail/jst-sales-america-inc/B2B-XH-A-LF-SN/1651045
R33 = RC0603FR-072KL: as R5 on sheet Power Supply; Part Number: RC0603FR-072KL; Value: 2K; Digikey Part Number: 311-2.00KHRCT-ND; Material: FR-07
R34 = RC0603FR-071KL: as R7 on sheet Power Supply; Part Number: RC0603FR-071KL; Value: 1k; Digikey Part Number: 311-1.00KHRCT-ND; Material: FR-07
R35 R36 R38 = RC0603FR-0710KL: Manufacturer: YAGEO; Tolerance: 0.01; Rated Power: 0.1W; Part Number: RC0603FR-0710KL; Value: 10k; Digikey Part Number: 311-10.0KHRCT-ND; Material: FR-07
R37 = 3296W-1-103LF: Manufacturer: Bournes Inc; Tolerance: 0.1; Rated Power: 0.5W; Part Number: 3296W-1-103LF; Value: 10K (Var); Digikey Part Number: 3296W-103LF-ND
R39 = RC0603JR-071K2L: Manufacturer: YAGEO; Tolerance: 0.01; Rated Power: 0.1W; Part Number: RC0603JR-071K2L; Value: 1.2k; Material: FR-07; Digikey Part Number: 311-1.2KGRCT-ND
U11 = CMP-110-000007-1: DIGITAL ISOLATOR, SINGLE CHANNEL; Digikey Link: #https://www.analog.com/media/en/technical-documentation/data-sheets/ADuM210N.pdf#; Part Number: ADuM210N
U12 = CMP-022-000013-1: IC COMP LO PWR SGL V SOT 23-5L; Part Number: TS391ILT
U13 = ADUM5401: Quad Channel 2.5kV Digital Isolator with isoPower; Manufacturer: Analogue Devices; Part Number: ADUM5401
U14 = ADS7028IRTER: IC ADC 12BIT SAR 16WQFN; Manufacturer: Texas Instruments; Part Number: ADS7028IRTER; Digikey Part Number: ADS7028IRTER; Digikey Link: https://www.digikey.com.au/en/products/detail/texas-instruments/ADS7028IRTER/12696020?s=N4IgTCBcDaIIIBEDKB2ADGAHASQEoBUBRXEAXQF8g

## Sheet HV Sense.SchDoc
size A4; SheetNumber: 7; SheetTotal: 11
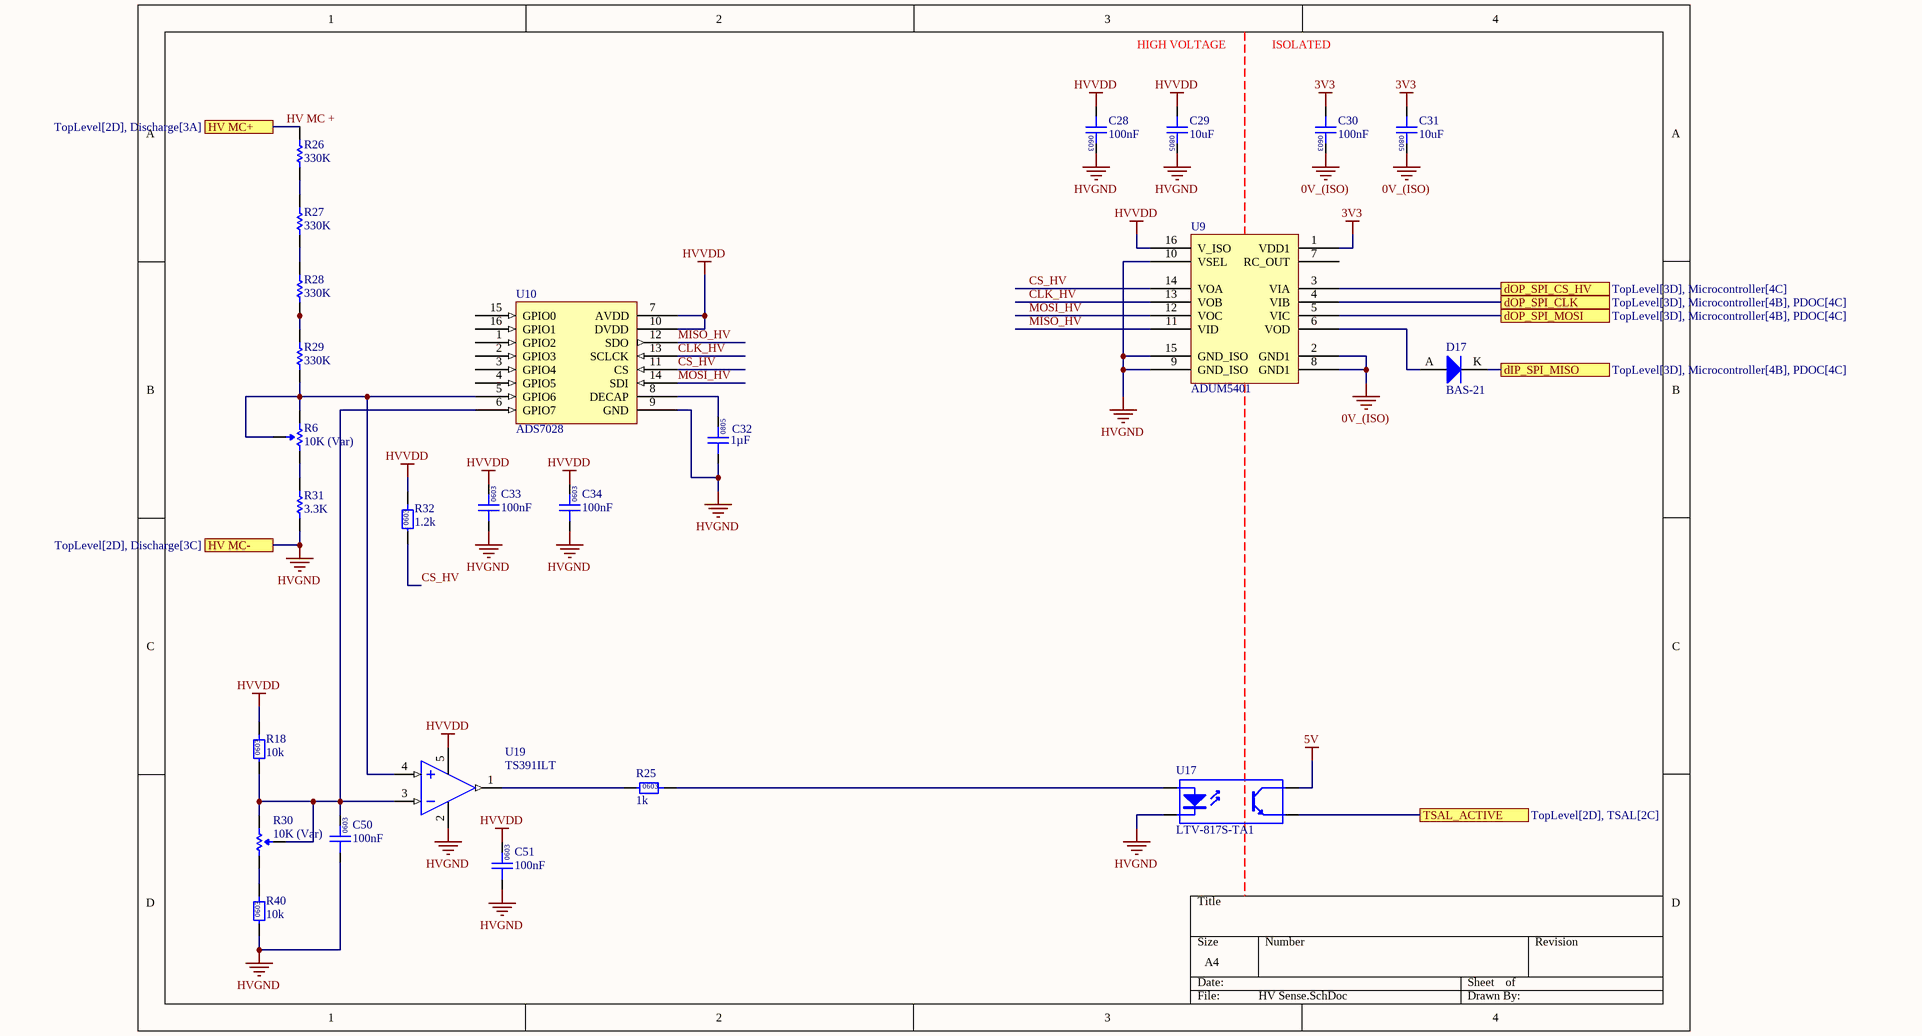
[diagram p6: HV Sense.SchDoc]

### Parts
C28  100nF  [0603]
C29  10uF  [0805]
C30  100nF  [0603]
C31  10uF  [0805]
C32  1µF  [0805]
C33  100nF  [0603]
C34  100nF  [0603]
C50  100nF  [0603]
C51  100nF  [0603]
D17  BAS-21  [NEXPERIA_SOT23]
R6  10K (Var)  [B 3296]
R18  10k  [0603]
R25  1k  [0603]
R26  330K  [VB 0207]
R27  330K  [VB 0207]
R28  330K  [VB 0207]
R29  330K  [VB 0207]
R30  10K (Var)  [B 3296]
R31  3.3K  [VB 0207]
R32  1.2k  [0603]
R40  10k  [0603]
U9  ADUM5401  [AD 16-SOIC]
U10  ADS7028  [WFQN-16]
U17  LTV-817S-TA1  [ON 4-SMD]
U19  TS391ILT  [ON SOT-23-5]

### Ports
dIP_SPI_MISO (see TopLevel[3D], Microcontroller[4B], PDOC[4C]), dOP_SPI_CLK (see TopLevel[3D], Microcontroller[4B], PDOC[4C]), dOP_SPI_CS_HV (see TopLevel[3D], Microcontroller[4C]), dOP_SPI_MOSI (see TopLevel[3D], Microcontroller[4B], PDOC[4C]), HV MC+ (see TopLevel[2D], Discharge[3A]), HV MC- (see TopLevel[2D], Discharge[3C]), TSAL_ACTIVE (see TopLevel[2D], TSAL[2C])

### Nets
0V_(ISO): C30.2 C31.2 U9.2(GND1) U9.8(GND1)
3V3: C30.1 C31.1 U9.1(VDD1)
5V: U17.4(C)
HVGND: C28.2 C29.2 C32.1 C33.1 C34.1 C50.1 C51.1 R31.1 R40.1 U9.9(GND_ISO) U9.10(VSEL) U9.15(GND_ISO) U10.9(GND) U17.2(K) U19.2(VCC-) ; port HV MC-  [project net HV MC-]
HVVDD: C28.1 C29.1 C33.2 C34.2 C51.2 R18.2 R32.2 U9.16(V_ISO) U10.7(AVDD) U10.10(DVDD) U19.5(VCC+)
CLK_HV: U9.13(VOB) U10.13(SCLCK)
CS_HV: R32.1 U9.14(VOA) U10.11(CS)
HV MC +: R26.2 ; port HV MC+
MISO_HV: U9.11(VID) U10.12(SDO)
MOSI_HV: U9.12(VOC) U10.14(SDI)
TSAL_ACTIVE: U17.3(E) ; port TSAL_ACTIVE
NetC32_2: C32.2 U10.8(DECAP)
NetC50_2: C50.2 R18.1 R30.1(CCW) R30.2(Wiper) U10.6(GPIO7) U19.3(IN-)
NetD17_A: D17.A U9.6(VOD)
NetD17_K: D17.K ; port dIP_SPI_MISO
NetR6_1: R6.1(CCW) R31.2
NetR6_2: R6.2(Wiper) R6.3(CW) R29.1 U10.5(GPIO6) U19.4(IIN+)
NetR22_1: U9.3(VIA) ; port dOP_SPI_CS_HV
NetR25_1: R25.1 U19.1(OUT)
NetR25_2: R25.2 U17.1(A)
NetR26_1: R26.1 R27.2
NetR27_1: R27.1 R28.2
NetR28_1: R28.1 R29.2
NetR30_3: R30.3(CW) R40.2
NetU8_12: U9.4(VIB) ; port dOP_SPI_CLK
NetU8_14: U9.5(VIC) ; port dOP_SPI_MOSI

Not connected (* = marked no-connect by the designer): U9 7(RC_OUT); U10 1(GPIO2) 2(GPIO3) 3(GPIO4) 4(GPIO5) 15(GPIO0) 16(GPIO1)

### Notes on the sheet
- HIGH VOLTAGE
- ISOLATED
- (in symbol GCM21BR71H105KA03L) 0805
- (in symbol GCM188L81H104KA57D) 0603
- (in symbol GRM21BR6YA106KE43L) 0805
- (in symbol RC0603FR-071KL) 0603
- (in symbol RC0603FR-0710KL) 0603
- (in symbol RC0603JR-071K2L) 0603

### Library data of the parts
C28 C30 C33 C34 C50 C51 = GCM188L81H104KA57D: as C10 on sheet Power Supply; Part Number: GCM188L81H104KA57D; Value: 100nF; Digikey Part Number: 490-6049-1-ND
C29 C31 = GRM21BR6YA106KE43L: as C8 on sheet Power Supply; Part Number: GRM21BR6YA106KE43L; Value: 10uF; Digikey Part Number: 490-10514-6-ND
C32 = GCM21BR71H105KA03L: as C16 on sheet Power Supply; Part Number: GCM21BR71H105KA03L; Value: 1µF; Digikey Part Number: 490-10675-1-ND
D17 = BAS-21: as D18 on sheet PDOC; Part Number: BAS-21
R6 R30 = 3296W-1-103LF: as R37 on sheet PDOC; Part Number: 3296W-1-103LF; Value: 10K (Var); Digikey Part Number: 3296W-103LF-ND
R18 R40 = RC0603FR-0710KL: as R35 on sheet PDOC; Part Number: RC0603FR-0710KL; Value: 10k; Digikey Part Number: 311-10.0KHRCT-ND; Material: FR-07
R25 = RC0603FR-071KL: as R7 on sheet Power Supply; Part Number: RC0603FR-071KL; Value: 1k; Digikey Part Number: 311-1.00KHRCT-ND; Material: FR-07
R26-R29 = MMB02070C3303FB200: Manufacturer: Vishay Beyschlag; Tolerance: 0.01; Rated Power: 1W; Part Number: MMB02070C3303FB200; Value: 330K; Digikey Part Number: MMB-330KBCT-ND
R31 = MMB02070C3301FB200: Manufacturer: Vishay Beyschlag; Tolerance: 0.01; Rated Voltage: 1W; Part Number: MMB02070C3301FB200; Value: 3.3K; Digikey Part Number: MMB-3.30KBCT-ND
R32 = RC0603JR-071K2L: as R39 on sheet PDOC; Part Number: RC0603JR-071K2L; Value: 1.2k; Material: FR-07; Digikey Part Number: 311-1.2KGRCT-ND
U9 = ADUM5401: as U13 on sheet PDOC; Part Number: ADUM5401
U10 = ADS7028IRTER: as U14 on sheet PDOC; Part Number: ADS7028IRTER; Digikey Part Number: ADS7028IRTER; Digikey Link: https://www.digikey.com.au/en/products/detail/texas-instruments/ADS7028IRTER/12696020?s=N4IgTCBcDaIIIBEDKB2ADGAHASQEoBUBRXEAXQF8g
U17 = LTV-817S-TA1: 35V 50ma Optocoupler (VF=1.2V); Manufacturer: Lite-On Inc; Part Number: LTV-817S-TA1; Digikey Part Number: 160-1893-2-ND; Digikey Link: https://www.digikey.com/product-detail/en/lite-on-inc/LTV-817S-TA1/160-1893-2-ND/388451
U19 = CMP-022-000013-1: IC COMP LO PWR SGL V SOT 23-5L; Part Number: TS391ILT

## Sheet Microcontroller.SchDoc
size A4; SheetNumber: 6; SheetTotal: 11
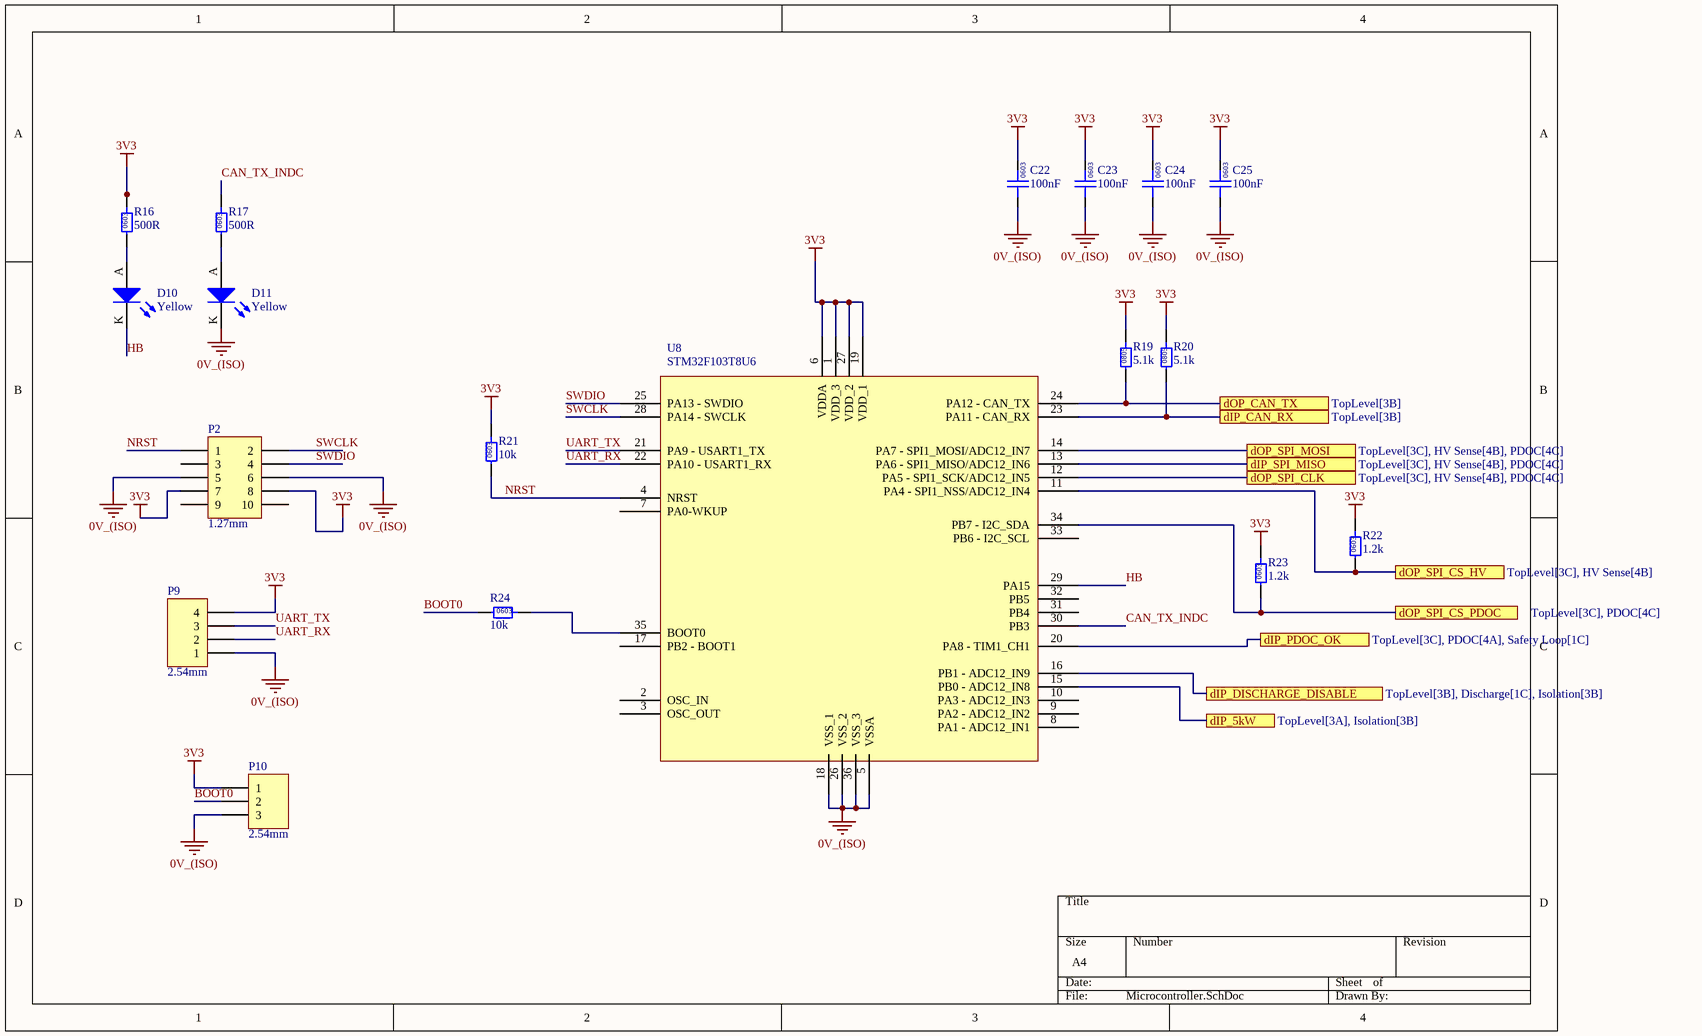
[diagram p7: Microcontroller.SchDoc]

### Parts
C22  100nF  [0603]
C23  100nF  [0603]
C24  100nF  [0603]
C25  100nF  [0603]
D10  Yellow  [0805 LED]
D11  Yellow  [0805 LED]
P2  1.27mm  [3221-10-0300-00]
P9  2.54mm  [TH 2.54mm Header 1x4]
P10  2.54mm  [TH 2.54mm Header 1x3]
R16  500R  [0603]
R17  500R  [0603]
R19  5.1k  [0805]
R20  5.1k  [0805]
R21  10k  [0603]
R22  1.2k  [0603]
R23  1.2k  [0603]
R24  10k  [0603]
U8  STM32F103T8U6  [STM_QFN-36]

### Ports
dIP_5kW (see TopLevel[3A], Isolation[3B]), dIP_CAN_RX (see TopLevel[3B]), dIP_DISCHARGE_DISABLE (see TopLevel[3B], Discharge[1C], Isolation[3B]), dIP_PDOC_OK (see TopLevel[3C], PDOC[4A], Safety Loop[1C]), dIP_SPI_MISO (see TopLevel[3C], HV Sense[4B], PDOC[4C]), dOP_CAN_TX (see TopLevel[3B]), dOP_SPI_CLK (see TopLevel[3C], HV Sense[4B], PDOC[4C]), dOP_SPI_CS_HV (see TopLevel[3C], HV Sense[4B]), dOP_SPI_CS_PDOC (see TopLevel[3C], PDOC[4C]), dOP_SPI_MOSI (see TopLevel[3C], HV Sense[4B], PDOC[4C])

### Nets
0V_(ISO): C22.1 C23.1 C24.1 C25.1 D11.K P2.5 P2.6 P9.1 P10.3 U8.5(VSSA) U8.18(VSS_1) U8.26(VSS_2) U8.36(VSS_3)
3V3: C22.2 C23.2 C24.2 C25.2 P2.7 P2.8 P9.4 P10.1 R16.2 R19.2 R20.2 R21.2 R22.2 R23.2 U8.1(VDD_3) U8.6(VDDA) U8.19(VDD_1) U8.27(VDD_2)
BOOT0: P10.2 R24.1
CAN_TX_INDC: R17.2 U8.30(PB3)
HB: D10.K U8.29(PA15)
NRST: P2.1 R21.1 U8.4(NRST)
SWCLK: P2.2 U8.28(PA14_-_SWCLK)
SWDIO: P2.4 U8.25(PA13_-_SWDIO)
UART_RX: P9.2 U8.22(PA10_-_USART1_RX)
UART_TX: P9.3 U8.21(PA9_-_USART1_TX)
NetD10_A: D10.A R16.1
NetD11_A: D11.A R17.1
NetD17_K: U8.13(PA6_-_SPI1_MISO/ADC12_IN6) ; port dIP_SPI_MISO
NetR9_1: U8.20(PA8_-_TIM1_CH1) ; port dIP_PDOC_OK
NetR11_1: U8.16(PB1_-_ADC12_IN9) ; port dIP_DISCHARGE_DISABLE
NetR19_1: R19.1 U8.24(PA12_-_CAN_TX) ; port dOP_CAN_TX
NetR20_1: R20.1 U8.23(PA11_-_CAN_RX) ; port dIP_CAN_RX
NetR22_1: R22.1 U8.11(PA4_-_SPI1_NSS/ADC12_IN4) ; port dOP_SPI_CS_HV
NetR23_1: R23.1 U8.34(PB7_-_I2C_SDA) ; port dOP_SPI_CS_PDOC
NetR24_2: R24.2 U8.35(BOOT0)
NetU8_12: U8.12(PA5_-_SPI1_SCK/ADC12_IN5) ; port dOP_SPI_CLK
NetU8_14: U8.14(PA7_-_SPI1_MOSI/ADC12_IN7) ; port dOP_SPI_MOSI
NetU8_15: U8.15(PB0_-_ADC12_IN8) ; port dIP_5kW

Not connected (* = marked no-connect by the designer): P2 3 9 10; U8 2(OSC_IN) 3(OSC_OUT) 7(PA0-WKUP) 8(PA1_-_ADC12_IN1) 9(PA2_-_ADC12_IN2) 10(PA3_-_ADC12_IN3) 17(PB2_-_BOOT1_) 31(PB4) 32(PB5) 33(PB6_-_I2C_SCL)

### Notes on the sheet
- (in symbol GCM188L81H104KA57D) 0603
- (in symbol RC0603FR-0710KL) 0603
- (in symbol RC0603JR-071K2L) 0603
- (in symbol RC0805FR075K1L) 0805
- (in symbol RT0603BRD07500RL) 0603

### Library data of the parts
C22-C25 = GCM188L81H104KA57D: as C10 on sheet Power Supply; Part Number: GCM188L81H104KA57D; Value: 100nF; Digikey Part Number: 490-6049-1-ND
D10 D11 = SML-211YTT86: Yellow LED Indication - Discrete 1.75V 0805 (2012 Metric); Manufacturer: ROHM Semiconductor; Part Number: SML-211YTT86; Colour: Yellow; Digikey Part Number: 511-1293-1-ND
P2 = SMD 1.27mm Header 2x5 (3221-10-0300-00): Positions: 10; Angle: 0; Flange: No; Contact: NA; Part Number: SMD 1.27mm Header 2x5 (3221-10-0300-00); Pitch: 1.27mm; Row Spacing: 1.27mm
P9 = TH 2.54mm Header 1x4: Positions: 4; Angle: 0; Flange: No; Contact: NA; Part Number: TH 2.54mm Header 1x4; Pitch: 2.54mm; Row Spacing: 2.54mm
P10 = TH 2.54mm Header 1x3: as P7 on sheet TopLevel; Part Number: TH 2.54mm Header 1x3; Pitch: 2.54mm; Row Spacing: 2.54mm
R16 R17 = RT0603BRD07500RL: Manufacturer: YAGEO; Tolerance: 0.01; Rated Power: 0.1W; Part Number: RT0603BRD07500RL; Value: 500R; Material: FR-07; Digikey Part Number: 13-RT0603BRD07500RL-ND
R19 R20 = RC0805FR075K1L: Manufacturer: YAGEO; Tolerance: 0.01; Rated Power: 0.125W; Part Number: RC0805FR075K1L; Value: 5.1k; Material: FR-07; Digikey Part Number: 311-5.10KCRCT-ND
R21 R24 = RC0603FR-0710KL: as R35 on sheet PDOC; Part Number: RC0603FR-0710KL; Value: 10k; Digikey Part Number: 311-10.0KHRCT-ND; Material: FR-07
R22 R23 = RC0603JR-071K2L: as R39 on sheet PDOC; Part Number: RC0603JR-071K2L; Value: 1.2k; Material: FR-07; Digikey Part Number: 311-1.2KGRCT-ND
U8 = STM32F103T8U6: ARM® Cortex®-M3 STM32F1 Microcontroller IC 32-Bit 72MHz 64KB (64K x 8) FLASH QFN; Manufacturer: ST Microelectronics; Part Number: STM32F103T8U6; Digikey Part Number: STM32F103T8U6; Digikey Link: https://www.digikey.com/en/products/detail/stmicroelectronics/stm32f103t8u6/1852493

## Sheet CAN.SchDoc
size A4; SheetNumber: 2; SheetTotal: 11
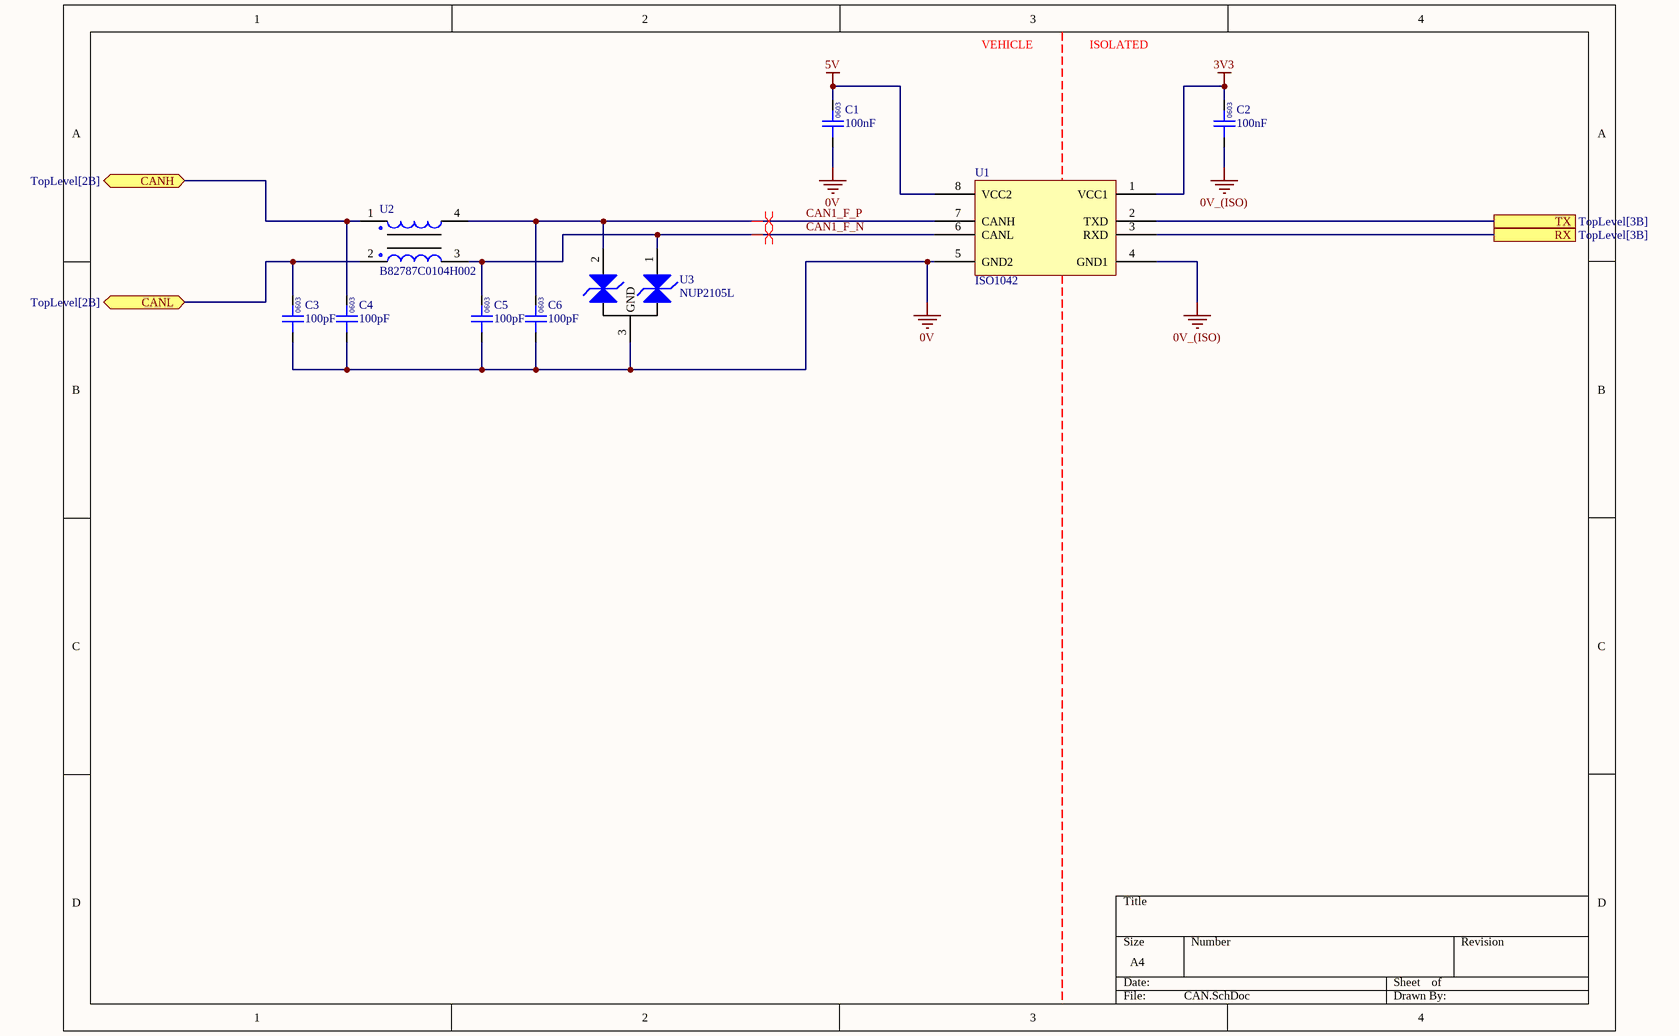
[diagram p8: CAN.SchDoc]

### Parts
C1  100nF  [0603]
C2  100nF  [0603]
C3  100pF  [0603]
C4  100pF  [0603]
C5  100pF  [0603]
C6  100pF  [0603]
U1  ISO1042  [TI-SOIC-8]
U2  B82787C0104H002  [TDK 4-PC Pad]
U3  NUP2105L  [ON SOT-23]

### Ports
CANH (bidir, see TopLevel[2B]), CANL (bidir, see TopLevel[2B]), RX (see TopLevel[3B]), TX (see TopLevel[3B])

### Nets
0V: C1.1 C3.1 C4.1 C5.1 C6.1 U1.5(GND2) U3.3(GND)
0V_(ISO): C2.1 U1.4(GND1)
3V3: C2.2 U1.1(VCC1)
5V: C1.2 U1.8(VCC2)
CAN1_F_N: C5.2 U1.6(CANL) U2.3 U3.1(CAN_H)
CAN1_F_P: C6.2 U1.7(CANH) U2.4 U3.2(CAN_L)
CAN1_N: C3.2 U2.2 ; port CANL
CAN1_P: C4.2 U2.1 ; port CANH
NetR19_1: U1.2(TXD) ; port TX
NetR20_1: U1.3(RXD) ; port RX

### Layout directives
differential pair: CAN1_F_N, CAN1_F_P

### Notes on the sheet
- VEHICLE
- ISOLATED
- (in symbol GCM188L81H104KA57D) 0603
- (in symbol GRM1885C1H101JA01D) 0603

### Library data of the parts
C1 C2 = GCM188L81H104KA57D: as C10 on sheet Power Supply; Part Number: GCM188L81H104KA57D; Value: 100nF; Digikey Part Number: 490-6049-1-ND
C3-C6 = GRM1885C1H101JA01D: Manufacturer: Murata Electronics; Rated Voltage: 50V; Tolerance: ±5%; Material: MLCC; Temperature Rating: C0G, NP0; Part Number: GRM1885C1H101JA01D; Value: 100pF; Digikey Part Number: 490-1427-1-ND
U1 = ISO1042: IC CAN TRANSCEIVER 1/1 8SOIC; Manufacturer: Texas Instruments; Part Number: ISO1042; Digikey Part Number: 296-ISO1042BQDWVQ1-ND
U2 = B82787C0104H002: Manufacturer: EPCOS (TDK); Value: 100µH @ 100kHz; Impedance: 5.8 kOhms @ 10MHz; Rated Current: 150mA; Part Number: B82787C0104H002; Material: Wirewound; Digikey Part Number: 495-4598-1-ND
U3 = NUP2105L: Dual Line CAN Bus Protector; Manufacturer: ON Semiconductor; Part Number: NUP2105L; Digikey Part Number: NUP2105LT1GOSCT-ND; Digikey Link: https://www.digikey.com/product-detail/en/on-semiconductor/NUP2105LT1G/NUP2105LT1GOSCT-ND/1485001

## Sheet 5kW Sensor.SchDoc
size A4; SheetNumber: 10; SheetTotal: 11
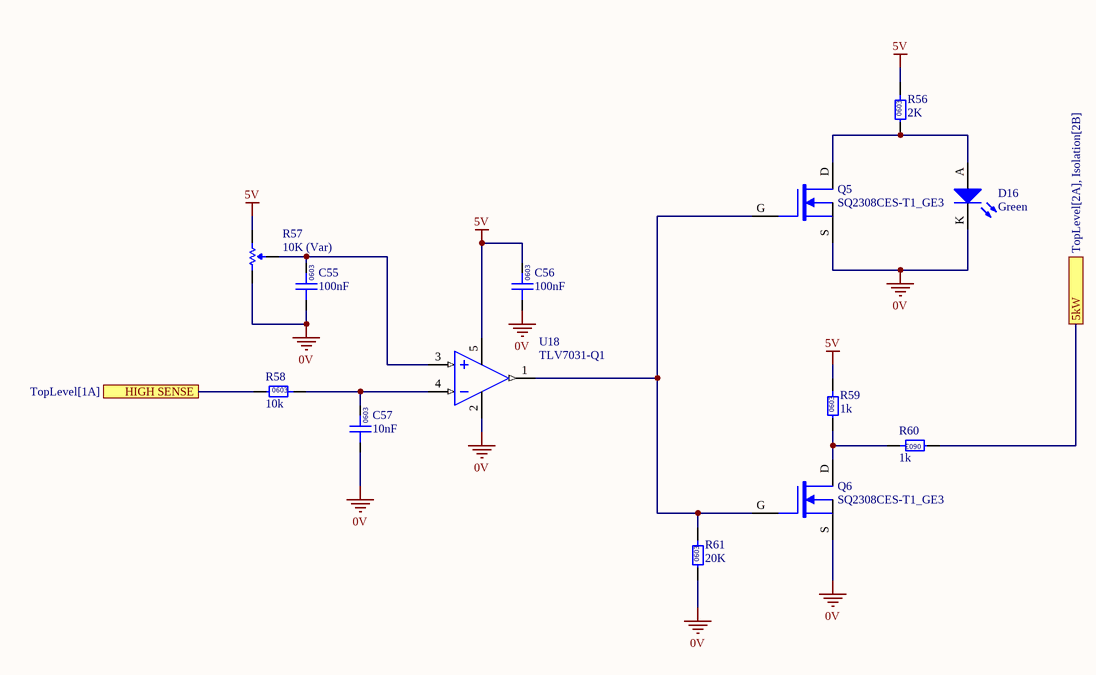
[diagram p9: 5kW Sensor.SchDoc]

### Parts
C55  100nF  [0603]
C56  100nF  [0603]
C57  10nF  [0603]
D16  Green  [0805 LED]
Q5  SQ2308CES-T1_GE3  [VSHY SOT-23-3]
Q6  SQ2308CES-T1_GE3  [VSHY SOT-23-3]
R56  2K  [0603]
R57  10K (Var)  [B 3296]
R58  10k  [0603]
R59  1k  [0603]
R60  1k  [0603]
R61  20K  [0603]
U18  TLV7031-Q1  [TI SOT-23-5]

### Ports
5kW (see TopLevel[2A], Isolation[2B]), HIGH SENSE (see TopLevel[1A])

### Nets
0V: C55.1 C56.1 C57.1 D16.K Q5.S Q6.S R57.3(CW) R61.1 U18.2(V-)
5V: C56.2 R56.2 R57.1(CCW) R59.2 U18.5(Vcc)
5kW: R60.1 ; port 5kW
HIGH_SENSE: R58.1 ; port HIGH SENSE
NetC55_2: C55.2 R57.2(Wiper) U18.3(IN+)
NetC57_2: C57.2 R58.2 U18.4(IN-)
NetD16_A: D16.A Q5.D R56.1
NetQ5_G: Q5.G Q6.G R61.2 U18.1(OUT)
NetQ6_D: Q6.D R59.1 R60.2

### Notes on the sheet
- (in symbol GCM188L81H103KA03D) 0603
- (in symbol GCM188L81H104KA57D) 0603
- (in symbol RC0603FR-071KL) 0603
- (in symbol RC0603FR-072KL) 0603
- (in symbol RC0603FR-0710KL) 0603
- (in symbol RC0603FR-0720KL) 0603

### Library data of the parts
C55 C56 = GCM188L81H104KA57D: as C10 on sheet Power Supply; Part Number: GCM188L81H104KA57D; Value: 100nF; Digikey Part Number: 490-6049-1-ND
C57 = GCM188L81H103KA03D: as C17 on sheet Power Supply; Part Number: GCM188L81H103KA03D; Value: 10nF; Digikey Part Number: 490-GCM188L81H103KA03DCT-ND
D16 = SML-210FTT86: as D6 on sheet Safety Loop; Part Number: SML-210FTT86; Colour: Green; Digikey Part Number: 511-1285-1-ND
Q5 Q6 = SQ2308CES-T1_GE3: as Q1 on sheet Safety Loop; Published: 24-Mar-1999; LatestRevisionDate: 29-May-2009; LatestRevisionNote: IPC-7351 Footprint Added.; PackageVersion: Sep-2000; PackageReference: SOT-343; Publisher: Altium Limited; PackageDescription: 4-Pin SOT-343 Package 1.3 mm Pitch, 2.1 mm Lead Span; Part Number: SQ2308CES-T1_GE3; Digikey Part Number: SQ2308CES-T1_GE3CT-ND
R56 = RC0603FR-072KL: as R5 on sheet Power Supply; Part Number: RC0603FR-072KL; Value: 2K; Material: FR-07; Digikey Part Number: 311-2.00KHRCT-ND
R57 = 3296W-1-103LF: as R37 on sheet PDOC; Part Number: 3296W-1-103LF; Value: 10K (Var); Digikey Part Number: 3296W-103LF-ND
R58 = RC0603FR-0710KL: as R35 on sheet PDOC; Part Number: RC0603FR-0710KL; Value: 10k; Material: FR-07; Digikey Part Number: 311-10.0KHRCT-ND
R59 R60 = RC0603FR-071KL: as R7 on sheet Power Supply; Part Number: RC0603FR-071KL; Value: 1k; Material: FR-07; Digikey Part Number: 311-1.00KHRCT-ND
R61 = RC0603FR-0720KL: as R3 on sheet Power Supply; Part Number: RC0603FR-0720KL; Value: 20K; Material: FR-07; Digikey Part Number: 311-20.0KHRCT-ND
U18 = TLV7031-Q1: Manufacturer: Texas Instruments; Input Voltage: 1.6 to 6.5 V; Channels: 1; Output: Push-Pull; Part Number: TLV7031-Q1; Digikey Part Number: 296-TLV7031QDBVRQ1CT-ND

## Sheet TSAL.SchDoc
size A3; SheetNumber: 11; SheetTotal: 11
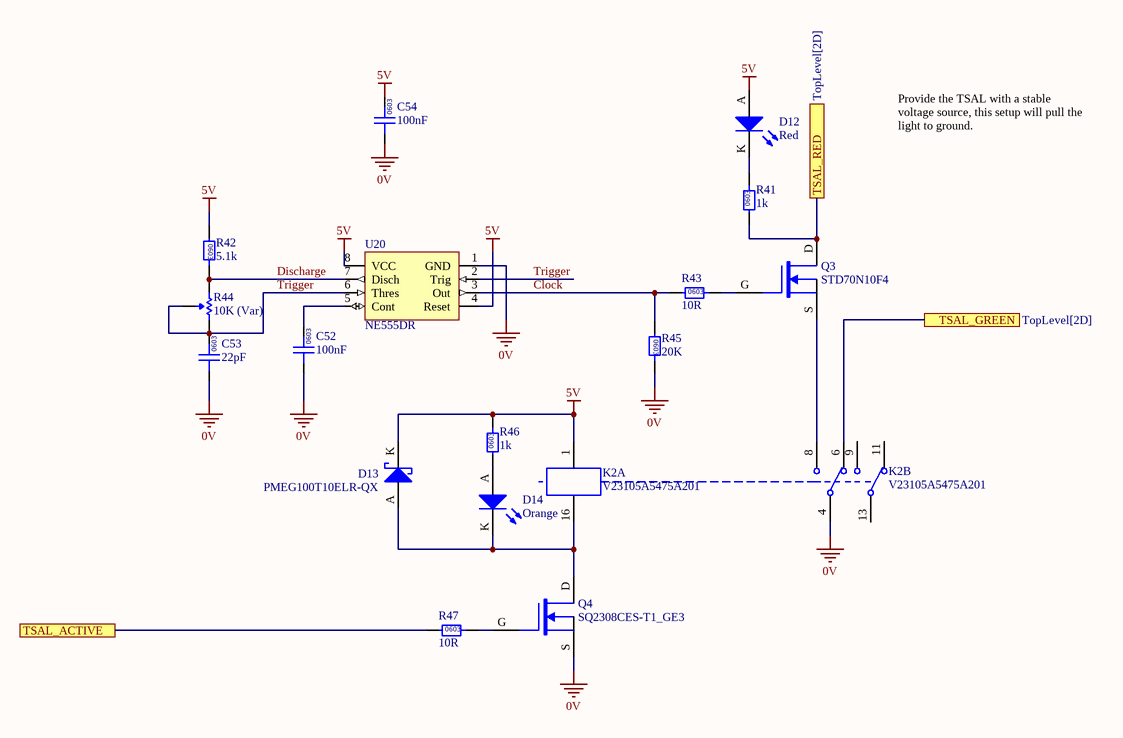
[diagram p10: TSAL.SchDoc]

### Parts
C52  100nF  [0603]
C53  22pF  [0603]
C54  100nF  [0603]
D12  Red  [0805 LED]
D13  PMEG100T10ELR-QX  [NXP SOD123W]
D14  Orange  [0805 LED]
K2  V23105A5475A201  [TI 2-DIL]  (parts A,B of 2)
Q3  STD70N10F4  [STM TO-252 MOSFET]
Q4  SQ2308CES-T1_GE3  [VSHY SOT-23-3]
R41  1k  [0603]
R42  5.1k  [0603]
R43  10R  [0603]
R44  10K (Var)  [B 3296]
R45  20K  [0603]
R46  1k  [0603]
R47  10R  [0603]
U20  NE555DR  [TI 8-SOIC]

### Ports
TSAL_ACTIVE, TSAL_GREEN (see TopLevel[2D]), TSAL_RED (see TopLevel[2D])

### Nets
0V: C52.1 C53.1 C54.1 K2.4 Q4.S R45.2 U20.1(GND)
5V: C54.2 D12.A D13.K K2.1 R42.1 R46.2 U20.4(Reset) U20.8(VCC)
Clock: R43.1 R45.1 U20.3(Out)
Discharge: R42.2 R44.3(CW) U20.7(Disch)
Trigger: C53.2 R44.1(CCW) R44.2(Wiper) U20.2(Trig) U20.6(Thres)
TSAL_ACTIVE: R47.1 ; port TSAL_ACTIVE
TSAL_GREEN: K2.6 ; port TSAL_GREEN
TSAL_RED: Q3.D R41.1 ; port TSAL_RED
NetC52_2: C52.2 U20.5(Cont)
NetD12_K: D12.K R41.2
NetD13_A: D13.A D14.K K2.16 Q4.D
NetD14_A: D14.A R46.1
NetK2_8: K2.8 Q3.S
NetQ3_G: Q3.G R43.2
NetQ4_G: Q4.G R47.2

Not connected (* = marked no-connect by the designer): K2 9 11 13

### Notes on the sheet
- Provide the TSAL with a stable voltage source, this setup will pull the light to ground.
- Section Leader Check:
- Date:
- Title:
- Revision
- Variant
- Project:
- Engineers:
- Sheet
- of
- (in symbol GCM188L81H104KA57D) 0603
- (in symbol GRM0335C1H220JA01D) 0603
- (in symbol RC0603FR-071KL) 0603
- (in symbol RC0603FR-0710RL) 0603
- (in symbol RC0603FR-0720KL) 0603
- (in symbol RC0603JR-075K1L) 0603

### Library data of the parts
C52 C54 = GCM188L81H104KA57D: as C10 on sheet Power Supply; Part Number: GCM188L81H104KA57D; Value: 100nF; Digikey Part Number: 490-6049-1-ND
C53 = GRM0335C1H220JA01D: Manufacturer: Murata Electronics; Rated Voltage: 50V; Tolerance: ±5%; Material: MLCC; Temperature Rating: C0G, NP0; Part Number: GRM0335C1H220JA01D; Value: 22pF; Digikey Part Number: 490-6123-1-ND
D12 = SML-210LTT86: as D2 on sheet Power Supply; Part Number: SML-210LTT86; Colour: Red; Digikey Part Number: 511-1286-1-ND
D13 = PMEG100T10ELR-QX: Manufacturer: Nexperia USA Inc.; Forward Voltage: 0.75 V @ 1A; Breakdown Voltage: 100 V; Rated Power: 680 mW; Part Number: PMEG100T10ELR-QX; Digikey Part Number: 1727-PMEG100T10ELR-QXCT-ND
D14 = SML-211DTT86: Orange LED Indication - Discrete 1.75V 0805 (2012 Metric); Manufacturer: ROHM Semiconductor; Part Number: SML-211DTT86; Colour: Orange; Digikey Part Number: 511-1291-1-ND
K2 = CMP-036-000001-1: 5V DPDT Relay 3A 220VDC; Part Number: V23105A5475A201
Q3 = STD70N10F4: N-Channel 100V 60A (Tc) 125W (Tc) Surface Mount DPAK; Manufacturer: STMicroelectronics; Published: 24-Mar-1999; LatestRevisionDate: 29-May-2009; LatestRevisionNote: IPC-7351 Footprint Added.; PackageVersion: Sep-2000; PackageReference: SOT-343; Publisher: Altium Limited; PackageDescription: 4-Pin SOT-343 Package 1.3 mm Pitch, 2.1 mm Lead Span; Part Number: STD70N10F4; Type: N-channel; Rated Power: 125W; Digikey Part Number: 497-8806-2-ND
Q4 = SQ2308CES-T1_GE3: as Q1 on sheet Safety Loop; Published: 24-Mar-1999; LatestRevisionDate: 29-May-2009; LatestRevisionNote: IPC-7351 Footprint Added.; PackageVersion: Sep-2000; PackageReference: SOT-343; Publisher: Altium Limited; PackageDescription: 4-Pin SOT-343 Package 1.3 mm Pitch, 2.1 mm Lead Span; Part Number: SQ2308CES-T1_GE3; Digikey Part Number: SQ2308CES-T1_GE3CT-ND
R41 R46 = RC0603FR-071KL: as R7 on sheet Power Supply; Part Number: RC0603FR-071KL; Value: 1k; Material: FR-07; Digikey Part Number: 311-1.00KHRCT-ND
R42 = RC0603JR-075K1L: Manufacturer: YAGEO; Tolerance: 0.01; Rated Power: 0.1W; Part Number: RC0603JR-075K1L; Value: 5.1k; Material: FR-07; Digikey Part Number: 311-5.1KGRCT-ND
R43 R47 = RC0603FR-0710RL: as R48 on sheet Isolation; Part Number: RC0603FR-0710RL; Value: 10R; Material: FR-07; Digikey Part Number: 311-10.0HRCT-ND
R44 = 3296W-1-103LF: as R37 on sheet PDOC; Part Number: 3296W-1-103LF; Value: 10K (Var); Digikey Part Number: 3296W-103LF-ND
R45 = RC0603FR-0720KL: as R3 on sheet Power Supply; Part Number: RC0603FR-0720KL; Value: 20K; Material: FR-07; Digikey Part Number: 311-20.0KHRCT-ND
U20 = CMP-022-000003-1: IC OSC SGL TIMER 100KHZ 8-SOIC; Part Number: NE555DR

## Nets that join several sheets
0V: TopLevel (P13.3), Power Supply (18 pins), Isolation (C27.1 C47.1 U15.4 U21.3), CAN (7 pins), 5kW Sensor (9 pins), TSAL (7 pins)
0V_(ISO): Power Supply (C26.1 R7.1 U6.5), Isolation (C48.1 U15.5), Safety Loop (Q1.S), Discharge (Q2.S), PDOC (7 pins), HV Sense (C30.2 C31.2 U9.2 U9.8), Microcontroller (13 pins), CAN (C2.1 U1.4)
3V3: Power Supply (C26.2 D5.A U6.7), Isolation (C48.2 U15.8), Safety Loop (D6.A D7.K K1.1), Discharge (D8.A D9.K U7.2), PDOC (5 pins), HV Sense (C30.1 C31.1 U9.1), Microcontroller (18 pins), CAN (C2.2 U1.1)
5V: TopLevel (P13.2 U16.2), Power Supply (9 pins), Isolation (C27.2 C47.2 U15.1 U21.5), HV Sense (U17.4), CAN (C1.2 U1.8), 5kW Sensor (5 pins), TSAL (8 pins)
GLV-: TopLevel (P1.1 P1.11), Power Supply (5 pins)
HV MC-: TopLevel (P6.1 P6.2 R2.2), Discharge (R15.2), HV Sense (15 pins)
5kW: TopLevel (P1.8), Isolation (U15.2), 5kW Sensor (R60.1)
CAN1_N: TopLevel (P1.5), CAN (C3.2 U2.2)
CAN1_P: TopLevel (P1.4), CAN (C4.2 U2.1)
DISCHARGE_DISABLE: TopLevel (U16.1), Isolation (R48.2 U21.2)
GL_INT: TopLevel (P7.2 P12.2), Safety Loop (K1.9)
GL_OUT: TopLevel (P1.9 P7.1), Safety Loop (K1.13)
GLV+: TopLevel (P1.12), Power Supply (F1.1)
HIGH_SENSE: TopLevel (P13.1), 5kW Sensor (R58.1)
HV MC +: TopLevel (P5.1 P5.2 R1.2), Discharge (R10.1), HV Sense (R26.2)
NetD17_K: PDOC (D18.K), HV Sense (D17.K), Microcontroller (U8.13)
NetR9_1: Safety Loop (R9.1), PDOC (U11.6), Microcontroller (U8.20)
NetR11_1: Isolation (U15.6), Discharge (R11.1), Microcontroller (U8.16)
NetR19_1: Microcontroller (R19.1 U8.24), CAN (U1.2)
NetR20_1: Microcontroller (R20.1 U8.23), CAN (U1.3)
NetR22_1: HV Sense (U9.3), Microcontroller (R22.1 U8.11)
NetR23_1: PDOC (U13.3), Microcontroller (R23.1 U8.34)
NetU8_12: PDOC (U13.4), HV Sense (U9.4), Microcontroller (U8.12)
NetU8_14: PDOC (U13.5), HV Sense (U9.5), Microcontroller (U8.14)
NetU8_15: Isolation (U15.7), Microcontroller (U8.15)
TSAL_ACTIVE: HV Sense (U17.3), TSAL (R47.1)
TSAL_GREEN: TopLevel (U16.3), TSAL (K2.6)
TSAL_RED: TopLevel (U16.4), TSAL (Q3.D R41.1)